# Altium project Printing.PrjPcb (part 2 of 4)

## Sheet Printing4.SchDoc
size A3
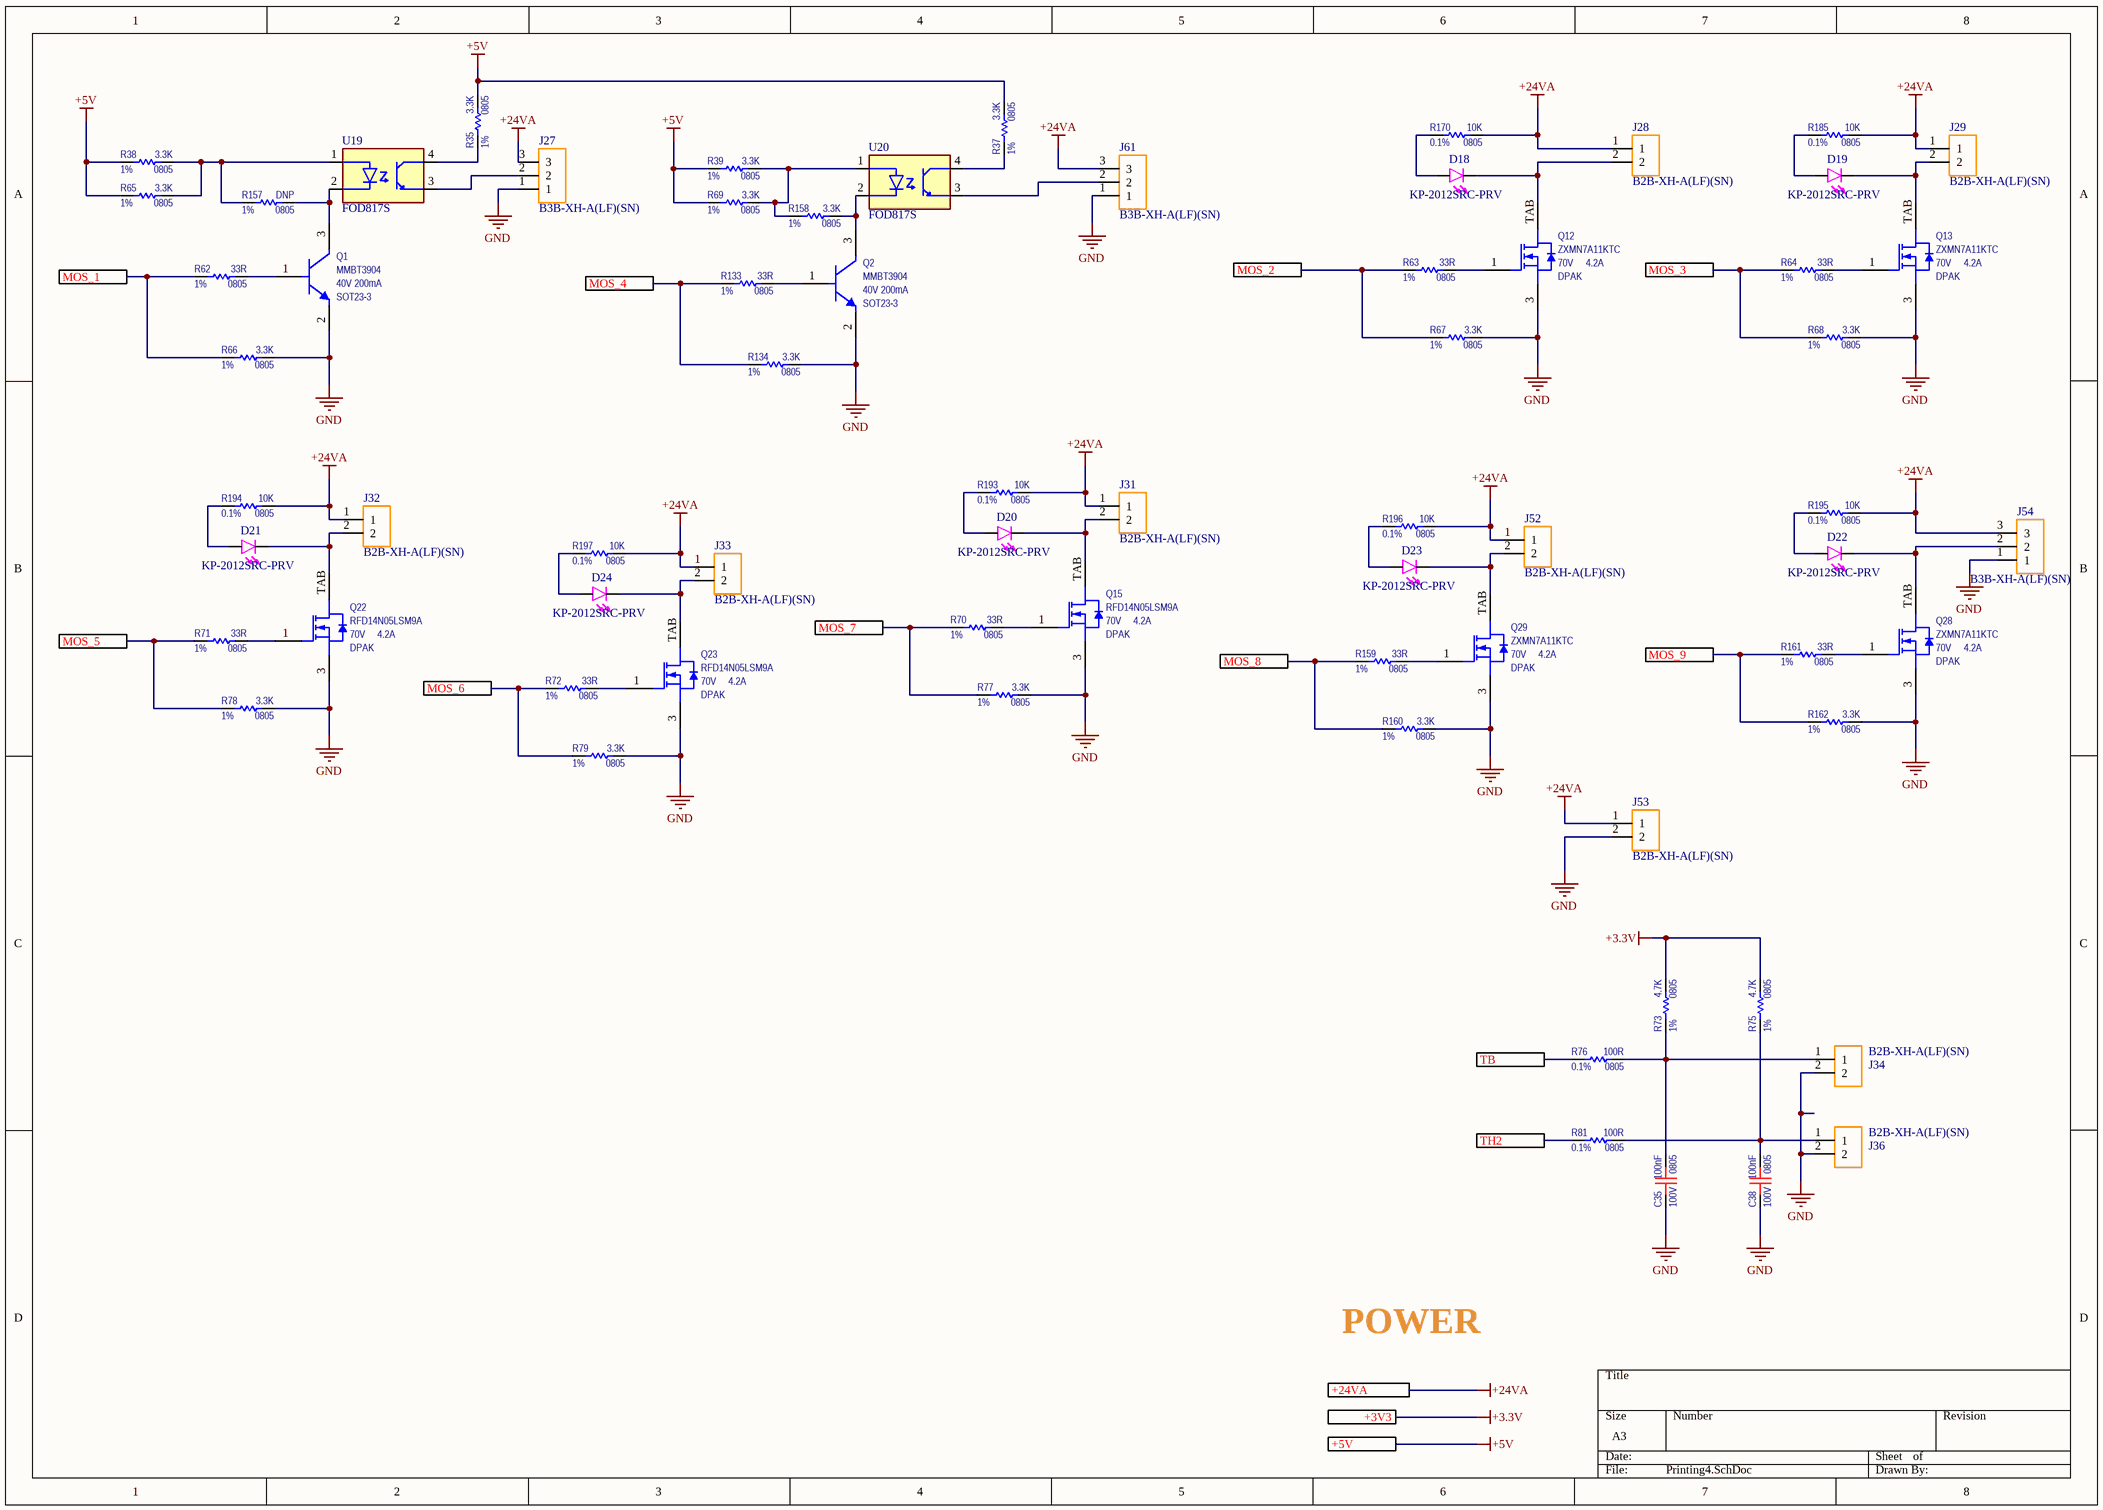
[diagram p3: Printing4.SchDoc]

### Parts
C35  value 100nF  Voltage: 100V  Package: 0805  [C_0805_GEN_1.40H]  (hidden comment: ESDSafeCapacitor)
C38  value 100nF  Voltage: 100V  Package: 0805  [C_0805_GEN_1.40H]  (hidden comment: ESDSafeCapacitor)
D18  KP-2012SRC-PRV  [0805 LED]
D19  KP-2012SRC-PRV  [0805 LED]
D20  KP-2012SRC-PRV  [0805 LED]
D21  KP-2012SRC-PRV  [0805 LED]
D22  KP-2012SRC-PRV  [0805 LED]
D23  KP-2012SRC-PRV  [0805 LED]
D24  KP-2012SRC-PRV  [0805 LED]
J27  B3B-XH-A(LF)(SN)  [JST_B3B-XH-A(LF)(SN)]
J28  B2B-XH-A(LF)(SN)  [JST_B2B-XH-A(LF)(SN)]
J29  B2B-XH-A(LF)(SN)  [JST_B2B-XH-A(LF)(SN)]
J31  B2B-XH-A(LF)(SN)  [JST_B2B-XH-A(LF)(SN)]
J32  B2B-XH-A(LF)(SN)  [JST_B2B-XH-A(LF)(SN)]
J33  B2B-XH-A(LF)(SN)  [JST_B2B-XH-A(LF)(SN)]
J34  B2B-XH-A(LF)(SN)  [JST_B2B-XH-A(LF)(SN)]
J36  B2B-XH-A(LF)(SN)  [JST_B2B-XH-A(LF)(SN)]
J52  B2B-XH-A(LF)(SN)  [JST_B2B-XH-A(LF)(SN)]
J53  B2B-XH-A(LF)(SN)  [JST_B2B-XH-A(LF)(SN)]
J54  B3B-XH-A(LF)(SN)  [JST_B3B-XH-A(LF)(SN)]
J61  B3B-XH-A(LF)(SN)  [JST_B3B-XH-A(LF)(SN)]
Q1  value MMBT3904  Current: 200mA  Voltage: 40V  Package: SOT23-3  [SOT23-3_MMBT3904,215]  (hidden comment: SingleNPN_B1E2C3)
Q2  value MMBT3904  Current: 200mA  Voltage: 40V  Package: SOT23-3  [SOT23-3_MMBT3904,215]  (hidden comment: SingleNPN_B1E2C3)
Q12  value ZXMN7A11KTC  Current: 4.2A  Voltage: 70V  Package: DPAK  [DPAK_SQD50N10-8M9L]  (hidden comment: SingleNMOS_G1S3DTAB)
Q13  value ZXMN7A11KTC  Current: 4.2A  Voltage: 70V  Package: DPAK  [DPAK_SQD50N10-8M9L]  (hidden comment: SingleNMOS_G1S3DTAB)
Q15  value RFD14N05LSM9A  Current: 4.2A  Voltage: 70V  Package: DPAK  [DPAK_SQD50N10-8M9L]  (hidden comment: SingleNMOS_G1S3DTAB)
Q22  value RFD14N05LSM9A  Current: 4.2A  Voltage: 70V  Package: DPAK  [DPAK_SQD50N10-8M9L]  (hidden comment: SingleNMOS_G1S3DTAB)
Q23  value RFD14N05LSM9A  Current: 4.2A  Voltage: 70V  Package: DPAK  [DPAK_SQD50N10-8M9L]  (hidden comment: SingleNMOS_G1S3DTAB)
Q28  value ZXMN7A11KTC  Current: 4.2A  Voltage: 70V  Package: DPAK  [DPAK_SQD50N10-8M9L]  (hidden comment: SingleNMOS_G1S3DTAB)
Q29  value ZXMN7A11KTC  Current: 4.2A  Voltage: 70V  Package: DPAK  [DPAK_SQD50N10-8M9L]  (hidden comment: SingleNMOS_G1S3DTAB)
R35  value 3.3K  Tolerance: 1%  Package: 0805  [R_0805_GEN_0.70H]  (hidden comment: StandardResistor)
R37  value 3.3K  Tolerance: 1%  Package: 0805  [R_0805_GEN_0.70H]  (hidden comment: StandardResistor)
R38  value 3.3K  Tolerance: 1%  Package: 0805  [R_0805_GEN_0.70H]  (hidden comment: StandardResistor)
R39  value 3.3K  Tolerance: 1%  Package: 0805  [R_0805_GEN_0.70H]  (hidden comment: StandardResistor)
R62  value 33R  Tolerance: 1%  Package: 0805  [R_0805_GEN_0.70H]  (hidden comment: StandardResistor)
R63  value 33R  Tolerance: 1%  Package: 0805  [R_0805_GEN_0.70H]  (hidden comment: StandardResistor)
R64  value 33R  Tolerance: 1%  Package: 0805  [R_0805_GEN_0.70H]  (hidden comment: StandardResistor)
R65  value 3.3K  Tolerance: 1%  Package: 0805  [R_0805_GEN_0.70H]  (hidden comment: StandardResistor)
R66  value 3.3K  Tolerance: 1%  Package: 0805  [R_0805_GEN_0.70H]  (hidden comment: StandardResistor)
R67  value 3.3K  Tolerance: 1%  Package: 0805  [R_0805_GEN_0.70H]  (hidden comment: StandardResistor)
R68  value 3.3K  Tolerance: 1%  Package: 0805  [R_0805_GEN_0.70H]  (hidden comment: StandardResistor)
R69  value 3.3K  Tolerance: 1%  Package: 0805  [R_0805_GEN_0.70H]  (hidden comment: StandardResistor)
R70  value 33R  Tolerance: 1%  Package: 0805  [R_0805_GEN_0.70H]  (hidden comment: StandardResistor)
R71  value 33R  Tolerance: 1%  Package: 0805  [R_0805_GEN_0.70H]  (hidden comment: StandardResistor)
R72  value 33R  Tolerance: 1%  Package: 0805  [R_0805_GEN_0.70H]  (hidden comment: StandardResistor)
R73  value 4.7K  Tolerance: 1%  Package: 0805  [R_0805_GEN_0.60H]  (hidden comment: StandardResistor)
R75  value 4.7K  Tolerance: 1%  Package: 0805  [R_0805_GEN_0.60H]  (hidden comment: StandardResistor)
R76  value 100R  Tolerance: 0.1%  Package: 0805  [R_0805_GEN_0.70H]  (hidden comment: StandardResistor)
R77  value 3.3K  Tolerance: 1%  Package: 0805  [R_0805_GEN_0.70H]  (hidden comment: StandardResistor)
R78  value 3.3K  Tolerance: 1%  Package: 0805  [R_0805_GEN_0.70H]  (hidden comment: StandardResistor)
R79  value 3.3K  Tolerance: 1%  Package: 0805  [R_0805_GEN_0.70H]  (hidden comment: StandardResistor)
R81  value 100R  Tolerance: 0.1%  Package: 0805  [R_0805_GEN_0.70H]  (hidden comment: StandardResistor)
R133  value 33R  Tolerance: 1%  Package: 0805  [R_0805_GEN_0.70H]  (hidden comment: StandardResistor)
R134  value 3.3K  Tolerance: 1%  Package: 0805  [R_0805_GEN_0.70H]  (hidden comment: StandardResistor)
R157  value DNP  Tolerance: 1%  Package: 0805  [R_0805_GEN_0.70H]  (hidden comment: StandardResistor)
R158  value 3.3K  Tolerance: 1%  Package: 0805  [R_0805_GEN_0.70H]  (hidden comment: StandardResistor)
R159  value 33R  Tolerance: 1%  Package: 0805  [R_0805_GEN_0.70H]  (hidden comment: StandardResistor)
R160  value 3.3K  Tolerance: 1%  Package: 0805  [R_0805_GEN_0.70H]  (hidden comment: StandardResistor)
R161  value 33R  Tolerance: 1%  Package: 0805  [R_0805_GEN_0.70H]  (hidden comment: StandardResistor)
R162  value 3.3K  Tolerance: 1%  Package: 0805  [R_0805_GEN_0.70H]  (hidden comment: StandardResistor)
R170  value 10K  Tolerance: 0.1%  Package: 0805  [R_0805_GEN_0.70H]  (hidden comment: StandardResistor)
R185  value 10K  Tolerance: 0.1%  Package: 0805  [R_0805_GEN_0.70H]  (hidden comment: StandardResistor)
R193  value 10K  Tolerance: 0.1%  Package: 0805  [R_0805_GEN_0.70H]  (hidden comment: StandardResistor)
R194  value 10K  Tolerance: 0.1%  Package: 0805  [R_0805_GEN_0.70H]  (hidden comment: StandardResistor)
R195  value 10K  Tolerance: 0.1%  Package: 0805  [R_0805_GEN_0.70H]  (hidden comment: StandardResistor)
R196  value 10K  Tolerance: 0.1%  Package: 0805  [R_0805_GEN_0.70H]  (hidden comment: StandardResistor)
R197  value 10K  Tolerance: 0.1%  Package: 0805  [R_0805_GEN_0.70H]  (hidden comment: StandardResistor)
U19  FOD817S  [SOIC254P1016X385-4N]
U20  FOD817S  [SOIC254P1016X385-4N]

### Ports
+3V3, +5V, +24VA, MOS_1, MOS_2, MOS_3, MOS_4, MOS_5, MOS_6, MOS_7, MOS_8, MOS_9, TB, TH2

### Nets
+3.3V: R73.2 R75.2 ; port +3V3  [project net +3V3]
+5V: R35.2 R37.2 R38.1 R39.1 R65.1 R69.1 ; port +5V
+24VA: J27.3 J28.1 J29.1 J31.1 J32.1 J33.1 J52.1 J53.1 J54.3 J61.3 R170.2 R185.2 R193.2 R194.2 R195.2 R196.2 R197.2 ; port +24VA
GND: C35.1 C38.1 J27.1 J34.2 J36.2 J53.2 J54.1 J61.1 Q1.2(EMITTER) Q2.2(EMITTER) Q12.3(SOURCE) Q13.3(SOURCE) Q15.3(SOURCE) Q22.3(SOURCE) Q23.3(SOURCE) Q28.3(SOURCE) Q29.3(SOURCE) R66.2 R67.2 R68.2 R77.2 R78.2 R79.2 R134.2 R160.2 R162.2
MOS_1: R62.1 R66.1 ; port MOS_1
MOS_2: R63.1 R67.1 ; port MOS_2
MOS_3: R64.1 R68.1 ; port MOS_3
MOS_4: R133.1 R134.1 ; port MOS_4
MOS_5: R71.1 R78.1 ; port MOS_5
MOS_6: R72.1 R79.1 ; port MOS_6
MOS_7: R70.1 R77.1 ; port MOS_7
MOS_8: R159.1 R160.1 ; port MOS_8
MOS_9: R161.1 R162.1 ; port MOS_9
TB: R76.1 ; port TB
TH2: R81.1 ; port TH2
NetC35_2: C35.2 J34.1 R73.1 R76.2
NetC38_2: C38.2 J36.1 R75.1 R81.2
NetD18_A: D18.A R170.1
NetD18_K: D18.K(C) J28.2 Q12.TAB(DRAIN)
NetD19_A: D19.A R185.1
NetD19_K: D19.K(C) J29.2 Q13.TAB(DRAIN)
NetD20_A: D20.A R193.1
NetD20_K: D20.K(C) J31.2 Q15.TAB(DRAIN)
NetD21_A: D21.A R194.1
NetD21_K: D21.K(C) J32.2 Q22.TAB(DRAIN)
NetD22_A: D22.A R195.1
NetD22_K: D22.K(C) J54.2 Q28.TAB(DRAIN)
NetD23_A: D23.A R196.1
NetD23_K: D23.K(C) J52.2 Q29.TAB(DRAIN)
NetD24_A: D24.A R197.1
NetD24_K: D24.K(C) J33.2 Q23.TAB(DRAIN)
NetJ27_2: J27.2 U19.3(EMITTER)
NetJ61_2: J61.2 U20.3(EMITTER)
NetQ1_1: Q1.1(BASE) R62.2
NetQ1_3: Q1.3(COLLECTOR) R157.2 U19.2(CATHODE)
NetQ2_1: Q2.1(BASE) R133.2
NetQ2_3: Q2.3(COLLECTOR) R158.2 U20.2(CATHODE)
NetQ12_1: Q12.1(GATE) R63.2
NetQ13_1: Q13.1(GATE) R64.2
NetQ15_1: Q15.1(GATE) R70.2
NetQ22_1: Q22.1(GATE) R71.2
NetQ23_1: Q23.1(GATE) R72.2
NetQ28_1: Q28.1(GATE) R161.2
NetQ29_1: Q29.1(GATE) R159.2
NetR35_1: R35.1 U19.4(COLLECTOR)
NetR37_1: R37.1 U20.4(COLLECTOR)
NetR38_2: R38.2 R65.2 R157.1 U19.1(ANODE)
NetR39_2: R39.2 R69.2 R158.1 U20.1(ANODE)

### Notes on the sheet
- POWER

### Library data of the parts
C35 C38 = CER_100nF_#4: CAP_CER_100nF_100V_X7R_10%_0805; Manufacturer#1: Kemet; Manufacturer#1 PN: C0805C104K1RECAUTO; Manufacturer#2 PN: ESD51C104K4T2A-24; Similar Part: C0805C104J1RECAUTO7210; C0805X104J1RECAUTO; Added by: İlhanT; FireANTs Code: C00062; Grade Level: Automotive; Lead Status: Pb-Free; Location: 3B16; Max Reflow Duration: 30; Max Reflow Temp: 260; Placement Area: 10.45; Power Rating: X; Temp# Operating: -55°C/+125°C; Tolerance: 10%; Identifier: CER_100nF_#4; Checked by: İlkerU; ComponentLink1Description: Resource Folder; ComponentLink1URL: C:\FireANTs_Repo\HW_Lib\trunk\ComponentLibrary\Resources\Capacitors\C00062; Cost: 0.27; Current: N/A; Failure in Time: N/A; Features: AEC-Q200; ESD withstanding; Height: 1.40; Manufacturer#2: AVX; MSL: 1; Mounting Type: SMD; Part Status: Active; Temp# Storage: N/A; Weight: 19mg
D18-D24 = KP-2012SRC-PRV: KP-2012SRC-PRV Red LED, 640 nm 2012 (0805), Rectangle Lens SMD package; Manufacturer: Kingbright; Lens Color: Clear; Viewing Angle: 120°; Lens Style: Rectangular,Diffused,Colorless; Number of LEDs: 1; Wavelength: 640nm; Luminous Intensity: 100mcd; Forward Voltage: 1.85V; Forward Current: 20mA; Supplier 1: Farnell; Manufacturer Part Number: KP-2012SRC-PRV; RoHS: Yes; Category: LEDs; Pricing 1: 5=0,12900, 50=0,10200, 100=0,09830, 500=0,08370, 1000=0,07290 (EUR); Mount: Surface Mount; Case/Package: 2012; Number of Pins: 2; Color: Red; Min Operating Temperature: -40°C; Max Operating Temperature: 85°C; Packaging: Cut Tape; Dominant Wavelength: 640nm; Radiation Hardening: No; Reach SVHC Compliant: Yes; RoHS Compliant: Yes; ComponentLink1URL: https://datasheet.ciiva.com/14176/kp2012src-prv-eng-tds-14176962.pdf?src-supplier=Distrelec; ComponentLink1Description: https://datasheet.ciiva.com/14176/kp2012src-prv-eng-tds-14176962.pdf?src-supplier=Distrelec; ComponentLink2URL: https://datasheet.ciiva.com/11773/0900766b8032fa8d-11773524.pdf?src-supplier=RSComponents; ComponentLink2Description: https://datasheet.ciiva.com/11773/0900766b8032fa8d-11773524.pdf?src-supplier=RSComponents; ComponentLink3URL: https://datasheet.ciiva.com/14634/0900766b8032fa8d-14634746.pdf?src-supplier=Allied+Electronics; ComponentLink3Description: https://datasheet.ciiva.com/14634/0900766b8032fa8d-14634746.pdf?src-supplier=Allied+Electronics; ComponentLink4URL: https://datasheet.ciiva.com/29281/180105-da-01-en-led-0805-typ-kp-2012src-prv-29281248.pdf?src-supplier=Conrad; ComponentLink4Description: https://datasheet.ciiva.com/29281/180105-da-01-en-led-0805-typ-kp-2012src-prv-29281248.pdf?src-supplier=Conrad; Supplier Part Number 1: 1318244
J28 J29 J31-J34 J36 J52 J53 = B2B-XH-A(LF)(SN): Connector Header Through Hole 2 position 0.098 (2.50mm); MF: JST Sales; MP: B2B-XH-A(LF)(SN); Package: None; SnapEDA_Link: https://www.snapeda.com/parts/B2B-XH-A(LF)(SN)/JST+Sales+America+Inc./view-part/?ref=snap; Purchase-URL: https://pricing.snapeda.com/search/part/B2B-XH-A(LF)(SN)/?ref=eda; Check_prices: https://www.snapeda.com/parts/B2B-XH-A(LF)(SN)/JST+Sales+America+Inc./view-part/?ref=eda; Availability: In Stock; Value: *; Price: None
Q1 Q2 = NPN_40V-200mA_#1: TRA_NPN_SING_40V_200mA_VSAT300mV_SOT23-3; Manufacturer#1: Nexperia; Manufacturer#1 PN: MMBT3904,215; Manufacturer#2 PN: MMBT3904-7-F; Similar Part: SST3904HZGT116; PMBT3904,235; Added by: HasanA; FireANTs Code: Q00012; Failure in Time: 0.44@[60%CL; 55°C; 0.7eV]; Grade Level: Industrial; Lead Status: Pb-Free; Location: 4D3; Max Reflow Duration: 30; Max Reflow Temp: 260; Placement Area: 14.00; Power Rating: X; Temp# Operating: -65°C/+150°C; Identifier: NPN_40V-200mA_#1; Checked by: EserC; ComponentLink1Description: Resource Folder; ComponentLink1URL: C:\BNA_Repo\HW_Lib\trunk\ComponentLibrary\Resources\Transistors\Q00012; Cost: 0.10; Features: Single NPN signal BJT; Height: 1.10; Manufacturer#2: Diodes; MSL: 1; Mounting Type: SMD; Part Status: Active; Temp# Storage: -65°C/+150°C; Tolerance: X; Weight: 7.48mg
Q12 Q13 Q15 Q22 Q23 Q28 Q29 = NMOS_100V-50A_#1: TRA_NMOS_SING_100V_50A_TH2V_DPAK; Manufacturer#1: Vishay; Manufacturer#1 PN: SQD50N10-8M9L; Similar Part: SQM70060EL_GE3; SQM100N10-10_GE3; Added by: İlhanT; FireANTs Code: Q00028; Failure in Time: 1.84@[60%CL; 55°C; 0.7eV]; Grade Level: Automotive; Lead Status: Pb-Free; Location: 4D7; Max Reflow Duration: 10; Max Reflow Temp: 260; Placement Area: 97.50; Power Rating: X; Temp# Operating: -55°C/+175°C; Identifier: NMOS_100V-50A_#1; Checked by: YasinY; ComponentLink1Description: Resource Folder; ComponentLink1URL: C:\BNA_Repo\HW_Lib\trunk\ComponentLibrary\Resources\Transistors\Q00028; Cost: 1.54; Features: AEC-Q101;  Single nMOS; Rdson=11.2mR@Vgs=4.5V@25°C; Qgate(tot)=70nC; Vgsmax=±20V; Height: 2.38; Manufacturer#2: N/A; Manufacturer#2 PN: N/A; MSL: 1; Mounting Type: SMD; Part Status: Active; Temp# Storage: -55°C/+175°C; Tolerance: X; Weight: 370mg
R35 R37-R39 R65-R69 R77-R79 R134 R157 R158 R160 R162 = STD_3.3K_#3: RES_STD_3.3K_0.125W_1%_100ppm_0805; Manufacturer#1: Yageo; Manufacturer#1 PN: AC0805FR-073K3L; Manufacturer#2 PN: ERJ-6ENF3301V; Added by: HasanA; FireANTs Code: R00131; Current: X; Grade Level: Automotive; Lead Status: Pb-Free; Location: 2G8; Max Reflow Duration: 10; Max Reflow Temp: 260; Placement Area: 10.45; Power Rating: 125mW; Temp# Operating: -55°C/+155°C; Voltage: 150V; Identifier: STD_3.3K_#3; Checked by: YasinY; ComponentLink1Description: Resource Folder; ComponentLink1URL: C:\FireANTs_Repo\HW_Lib\trunk\ComponentLibrary\Resources\Resistors\R00131; Cost: 0.10; Failure in Time: N/A; Features: AEC-Q200; Height: 0.70; Manufacturer#2: Panasonic; MSL: 1; Mounting Type: SMD; Part Status: Active; Similar Part: N/A; Temp# Storage: N/A; Weight: 5.5mg
R62-R64 R70-R72 R133 R159 R161 = STD_33R_#3: RES_STD_33R_0.125W_1%_100ppm_0805; Manufacturer#1: Yageo; Manufacturer#1 PN: AC0805FR-0733RL; Manufacturer#2 PN: ERJ-6ENF33R0V; Added by: HasanA; FireANTs Code: R00051; Current: X; Grade Level: Automotive; Lead Status: Pb-Free; Location: 2C13; Max Reflow Duration: 10; Max Reflow Temp: 260; Placement Area: 10.45; Power Rating: 125mW; Temp# Operating: -55°C/+155°C; Voltage: 150V; Identifier: STD_33R_#3; Checked by: YasinY; ComponentLink1Description: Resource Folder; ComponentLink1URL: C:\FireANTs_Repo\HW_Lib\trunk\ComponentLibrary\Resources\Resistors\R00051; Cost: 0.10; Failure in Time: N/A; Features: AEC-Q200; Height: 0.70; Manufacturer#2: Panasonic; MSL: 1; Mounting Type: SMD; Part Status: Active; Similar Part: N/A; Temp# Storage: N/A; Weight: 5.5mg
R73 R75 = STD_4.7K_#3: RES_STD_4.7K_0.125W_1%_100ppm_0805; Manufacturer#1: Yageo; Manufacturer#1 PN: AC0805FR-074K7L; Manufacturer#2 PN: ERJ-6ENF4701V; Added by: SonerI; FireANTs Code: R00230; Current: X; Grade Level: Automotive; Lead Status: Pb-Free; Location: TBD; Max Reflow Duration: 10; Max Reflow Temp: 260; Placement Area: 10.45; Power Rating: 125mW; Temp# Operating: -55°C/+155°C; Voltage: 150V; Identifier: STD_4.7K_#3; Checked by: YasinY; ComponentLink1Description: Resource Folder; ComponentLink1URL: C:\FireANTs_Repo\HW_Lib\trunk\ComponentLibrary\Resources\Resistors\R00230; Cost: 0.10; Failure in Time: N/A; Features: AEC-Q200; Height: 0.60; Manufacturer#2: Panasonic; MSL: 1; Mounting Type: SMD; Part Status: Active; Similar Part: N/A; Temp# Storage: N/A; Weight: 5.5mg
R76 R81 = STD_100R_#5: RES_STD_100R_0.125W_0.1%_10ppm_0805; Manufacturer#1: Yageo; Manufacturer#1 PN: RT0805BRB07100RL; Manufacturer#2 PN: RQ73C2A100RBTD; Similar Part: RNCF0805TKY100R; RG2012N-101-W-T1; Added by: HasanA; FireANTs Code: R00072; Current: X; Grade Level: Industrial; Lead Status: Pb-Free; Location: 2D18; Max Reflow Duration: 10; Max Reflow Temp: 260; Placement Area: 10.45; Power Rating: 125mW; Temp# Operating: -55°C/+155°C; Voltage: 150V; Identifier: STD_100R_#5; Checked by: YasinY; ComponentLink1Description: Resource Folder; ComponentLink1URL: C:\FireANTs_Repo\HW_Lib\trunk\ComponentLibrary\Resources\Resistors\R00072; Cost: 0.73; Failure in Time: N/A; Features: N/A; Height: 0.70; Manufacturer#2: TE Connectivity; MSL: 1; Mounting Type: SMD; Part Status: Active; Temp# Storage: N/A; Weight: 5.5mg
R170 R185 R193-R197 = STD_2K_#7: RES_STD_2K_0.125W_0.1%_25ppm_0805; Manufacturer#1: Panasonic; Manufacturer#1 PN: ERA-6AEB202V; Manufacturer#2 PN: RG2012P-202-B-T5; Similar Part: ERA-6ARB202V; Added by: İlhanT; FireANTs Code: R00087; Current: X; Grade Level: Automotive; Lead Status: Pb-Free; Location: 2C22; Max Reflow Duration: 10; Max Reflow Temp: 260; Placement Area: 10.45; Power Rating: 125mW; Temp# Operating: -55°C/+155°C; Voltage: 100V; Identifier: STD_2K_#7; Checked by: YasinY; ComponentLink1Description: Resource Folder; ComponentLink1URL: C:\FireANTs_Repo\HW_Lib\trunk\ComponentLibrary\Resources\Resistors\R00087; Cost: 0.31; Failure in Time: N/A; Features: AEC-Q200; Height: 0.70; Manufacturer#2: Susumu; MSL: 1; Mounting Type: SMD; Part Status: Active; Temp# Storage: N/A; Weight: 5.5mg
U19 U20 = FOD817S: Optoisolator Transistor Output 5000Vrms 1 Channel 4-SMD; MF: ON Semiconductor; Price: None; Availability: Unavailable; Package: SMD-4 ON Semiconductor; SnapEDA_Link: https://www.snapeda.com/parts/FOD817S/ON%20Semiconductor/view-part/2890432/?ref=snap; MP: FOD817S; Value: *
J27 J54 J61 = B3B-XH-A(LF)(SN): Value: *; MP: B3B-XH-A(LF)(SN); Availability: Unavailable; Package: None; Price: None

## Sheet Printing6.SchDoc
size A3
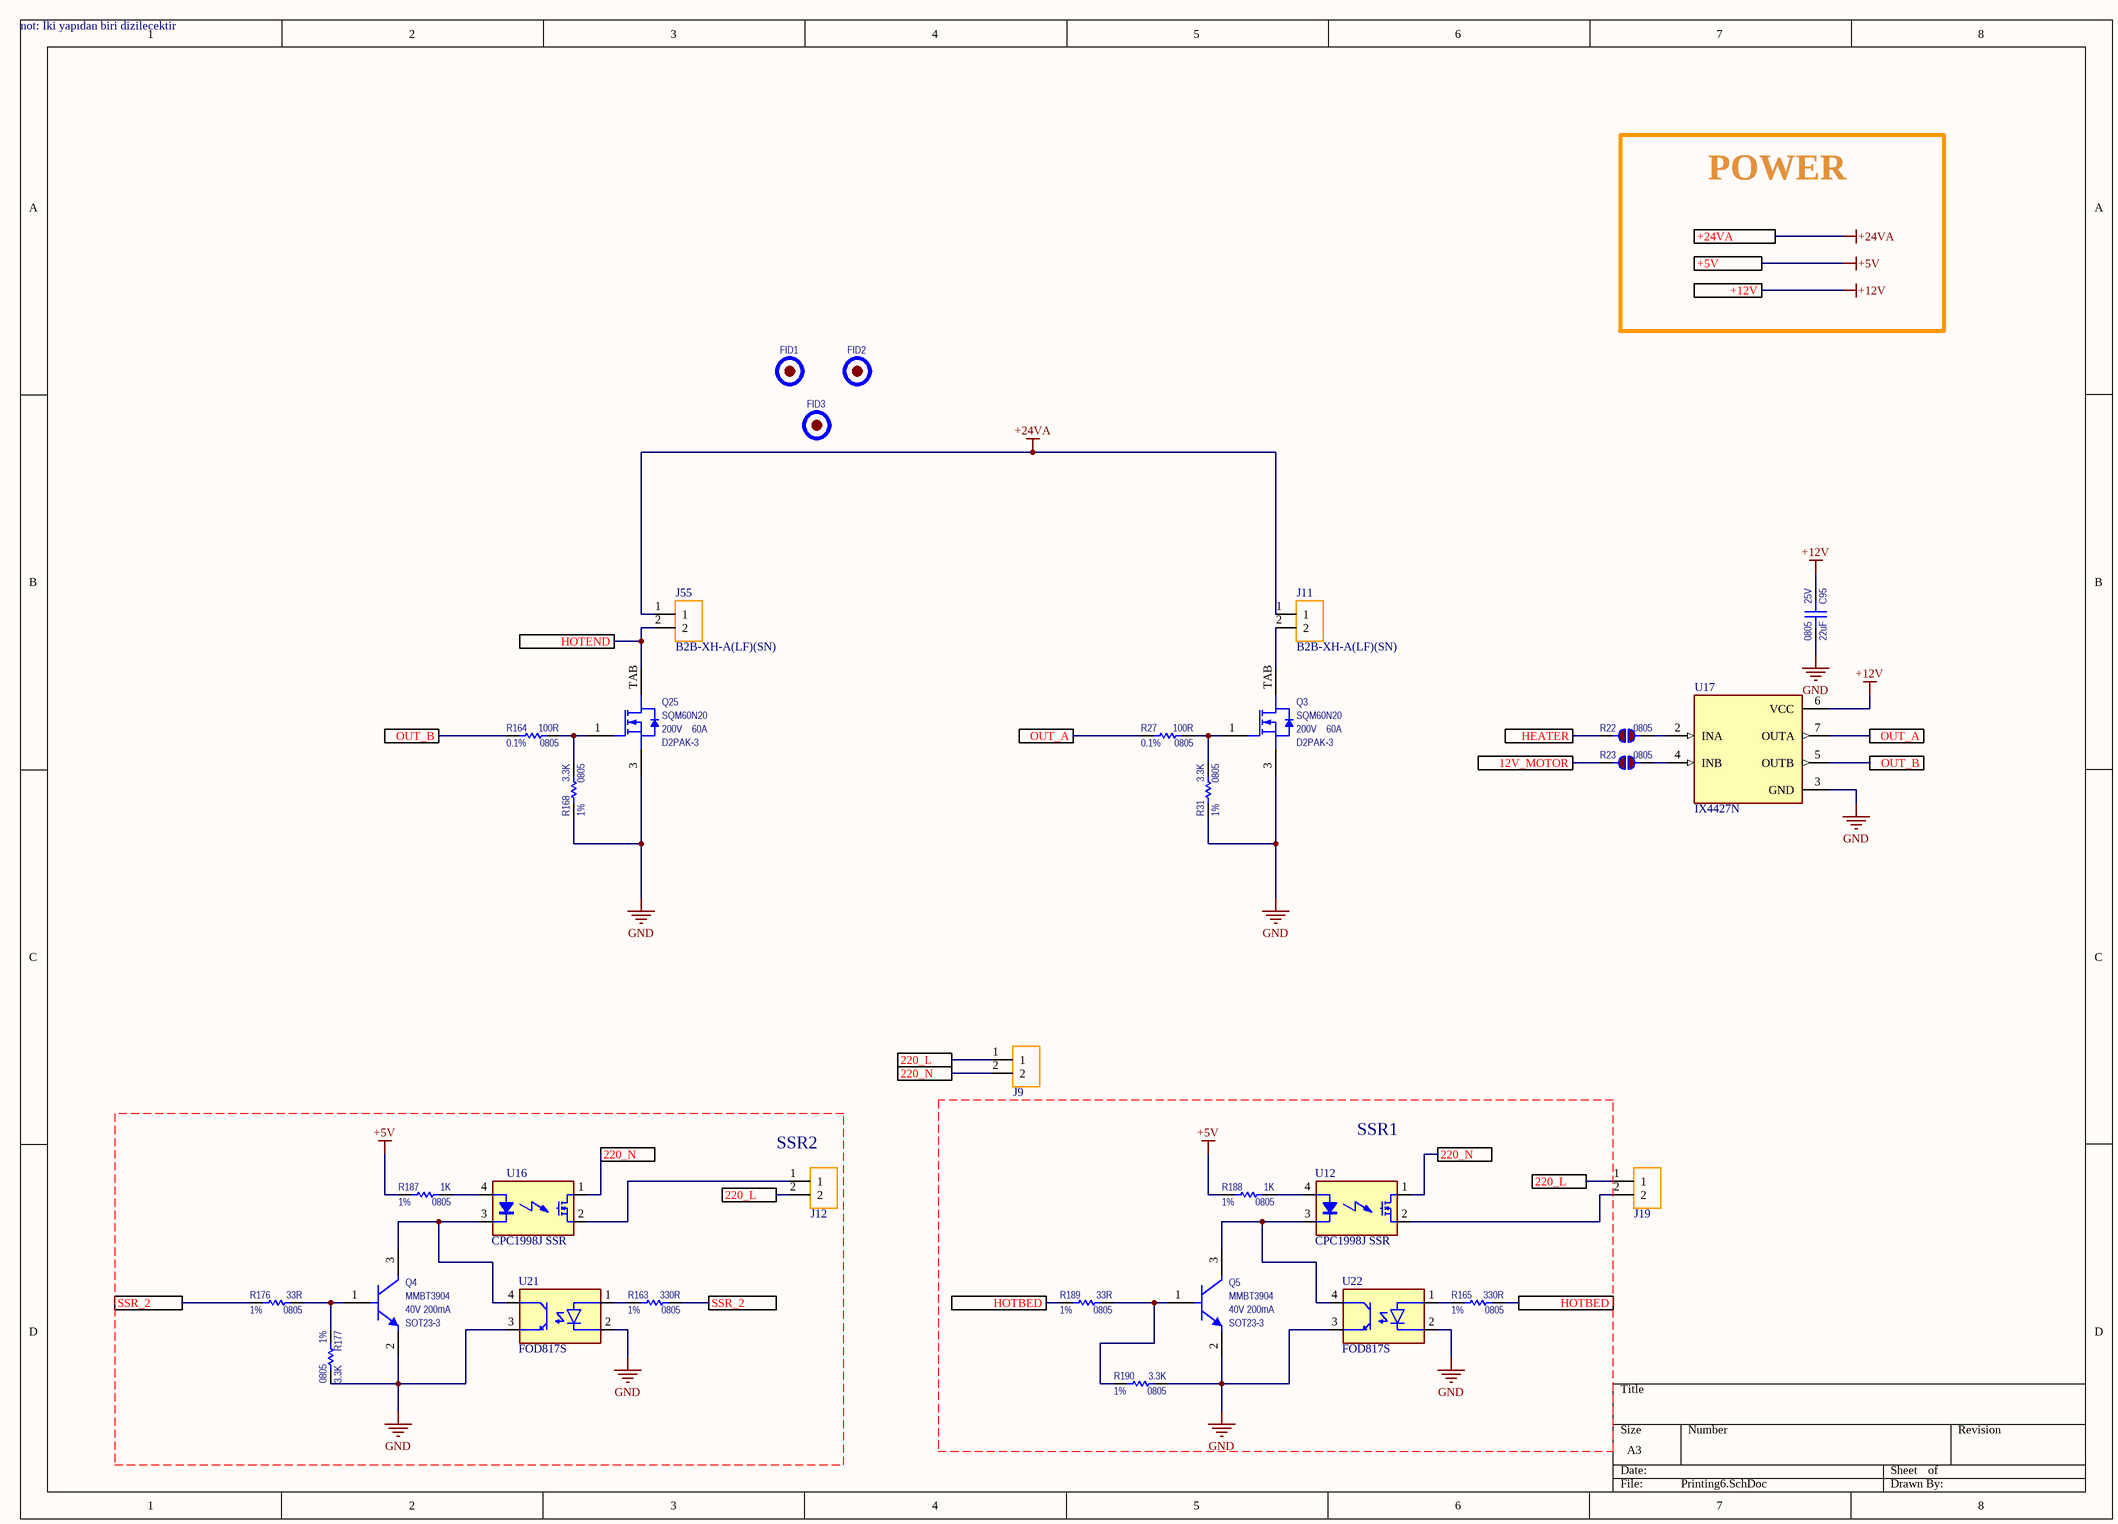
[diagram p4: Printing6.SchDoc]

### Parts
C95  value 22uF  Voltage: 25V  Package: 0805  [C_0805_GEN_1.40H]  (hidden comment: Capacitor)
FID1  Fiducial_1.00x3.00  [SMD_1.00x3.00_FID]  (value not drawn)
FID2  Fiducial_1.00x3.00  [SMD_1.00x3.00_FID]  (value not drawn)
FID3  Fiducial_1.00x3.00  [SMD_1.00x3.00_FID]  (value not drawn)
J9  5.08 Klemens  [5.08 Klemens]  (value not drawn)
J11  B2B-XH-A(LF)(SN)  [JST_B2B-XH-A(LF)(SN)]
J12  5.08 Klemens  [5.08 Klemens]  (value not drawn)
J19  5.08 Klemens  [5.08 Klemens]  (value not drawn)
J55  B2B-XH-A(LF)(SN)  [JST_B2B-XH-A(LF)(SN)]
Q3  value SQM60N20  Current: 60A  Voltage: 200V  Package: D2PAK-3  [D2PAK-3_SQM60N20-35]  (hidden comment: SingleNMOS_G1S3DTAB)
Q4  value MMBT3904  Current: 200mA  Voltage: 40V  Package: SOT23-3  [SOT23-3_MMBT3904,215]  (hidden comment: SingleNPN_B1E2C3)
Q5  value MMBT3904  Current: 200mA  Voltage: 40V  Package: SOT23-3  [SOT23-3_MMBT3904,215]  (hidden comment: SingleNPN_B1E2C3)
Q25  value SQM60N20  Current: 60A  Voltage: 200V  Package: D2PAK-3  [D2PAK-3_SQM60N20-35]  (hidden comment: SingleNMOS_G1S3DTAB)
R22  Package: 0805  [R_0805_GEN_0.70H]  (hidden comment: StandardJumper)
R23  Package: 0805  [R_0805_GEN_0.70H]  (hidden comment: StandardJumper)
R27  value 100R  Tolerance: 0.1%  Package: 0805  [R_0805_GEN_0.70H]  (hidden comment: StandardResistor)
R31  value 3.3K  Tolerance: 1%  Package: 0805  [R_0805_GEN_0.70H]  (hidden comment: StandardResistor)
R163  value 330R  Tolerance: 1%  Package: 0805  [R_0805_GEN_0.70H]  (hidden comment: StandardResistor)
R164  value 100R  Tolerance: 0.1%  Package: 0805  [R_0805_GEN_0.70H]  (hidden comment: StandardResistor)
R165  value 330R  Tolerance: 1%  Package: 0805  [R_0805_GEN_0.70H]  (hidden comment: StandardResistor)
R168  value 3.3K  Tolerance: 1%  Package: 0805  [R_0805_GEN_0.70H]  (hidden comment: StandardResistor)
R176  value 33R  Tolerance: 1%  Package: 0805  [R_0805_GEN_0.70H]  (hidden comment: StandardResistor)
R177  value 3.3K  Tolerance: 1%  Package: 0805  [R_0805_GEN_0.70H]  (hidden comment: StandardResistor)
R187  value 1K  Tolerance: 1%  Package: 0805  [R_0805_GEN_0.70H]  (hidden comment: StandardResistor)
R188  value 1K  Tolerance: 1%  Package: 0805  [R_0805_GEN_0.70H]  (hidden comment: StandardResistor)
R189  value 33R  Tolerance: 1%  Package: 0805  [R_0805_GEN_0.70H]  (hidden comment: StandardResistor)
R190  value 3.3K  Tolerance: 1%  Package: 0805  [R_0805_GEN_0.70H]  (hidden comment: StandardResistor)
U12  CPC1998J SSR  [I4-PAC]
U16  CPC1998J SSR  [I4-PAC]
U17  IX4427N  [SOIC127P600X175-8N]
U21  FOD817S  [SOIC254P1016X385-4N]
U22  FOD817S  [SOIC254P1016X385-4N]

### Ports
12V_MOTOR, 220_L, 220_N, +5V, +12V, +24VA, HEATER, HOTBED, HOTEND, OUT_A, OUT_B, SSR_2

### Nets
+5V: R187.1 R188.1 ; port +5V
+12V: C95.1 U17.6(VCC) ; port +12V
+24VA: J11.1 J55.1 ; port +24VA
GND: C95.2 Q3.3(SOURCE) Q4.2(EMITTER) Q5.2(EMITTER) Q25.3(SOURCE) R31.1 R168.1 R177.2 R190.2 U17.3(GND) U21.2(CATHODE) U21.3(EMITTER) U22.2(CATHODE) U22.3(EMITTER)
12V_MOTOR: R23.1 ; port 12V_MOTOR
220_L: J9.1 J12.2 J19.1 ; port 220_L
220_N: J9.2 U12.1(DS1) U16.1(DS1) ; port 220_N
HEATER: R22.1 ; port HEATER
HOTBED: R165.2 R189.1 ; port HOTBED
HOTEND: J55.2 Q25.TAB(DRAIN) ; port HOTEND
OUT_A: R27.1 U17.7(OUTA) ; port OUT_A
OUT_B: R164.1 U17.5(OUTB) ; port OUT_B
SSR_2: R163.2 R176.1 ; port SSR_2
NetJ11_2: J11.2 Q3.TAB(DRAIN)
NetJ12_1: J12.1 U16.2(DS2)
NetJ19_2: J19.2 U12.2(DS2)
NetQ3_1: Q3.1(GATE) R27.2 R31.2
NetQ4_1: Q4.1(BASE) R176.2 R177.1
NetQ4_3: Q4.3(COLLECTOR) U16.3(K) U21.4(COLLECTOR)
NetQ5_1: Q5.1(BASE) R189.2 R190.1
NetQ5_3: Q5.3(COLLECTOR) U12.3(K) U22.4(COLLECTOR)
NetQ25_1: Q25.1(GATE) R164.2 R168.2
NetR22_2: R22.2 U17.2(INA)
NetR23_2: R23.2 U17.4(INB)
NetR163_1: R163.1 U21.1(ANODE)
NetR165_1: R165.1 U22.1(ANODE)
NetR187_2: R187.2 U16.4(A)
NetR188_2: R188.2 U12.4(A)

### Notes on the sheet
- not: İki yapıdan biri dizilecektir
- POWER
- SSR1
- (near J12) SSR2

### Library data of the parts
C95 = CER_22uF_#6: CAP_CER_22uF_25V_X5R_20%_0805; Manufacturer#1: Murata; Manufacturer#1 PN: GRM21BR61E226ME44L; Manufacturer#2 PN: CC0805MKX5R8BB226; Similar Part: GRT21BR61E226ME13L; C2012X5R1V226M125AC; Added by: HasanA; FireANTs Code: C00159; Grade Level: Industrial; Lead Status: Pb-Free; Location: 3G15; Max Reflow Duration: 30; Max Reflow Temp: 260; Placement Area: 10.45; Power Rating: X; Temp# Operating: -55°C/+85°C; Tolerance: 20%; Identifier: CER_22uF_#6; Checked by: İlkerU; ComponentLink1Description: Resource Folder; ComponentLink1URL: C:\FireANTs_Repo\HW_Lib\trunk\ComponentLibrary\Resources\Capacitors\C00159; Cost: 0.54; Current: N/A; Failure in Time: N/A; Features: N/A; Height: 1.40; Manufacturer#2: Yageo; MSL: 1; Mounting Type: SMD; Part Status: Active; Temp# Storage: N/A; Weight: 19mg
FID1-FID3 = FID_1.00X3.00: SUP_FID_1.00x3.00_SMD; Value: X; Added by: İlhanT; Placement Area: 12.56; Package: X; Identifier: FID_1.00X3.00; FireANTs Code: X; Checked by: HasanA; ComponentLink1Description: X; ComponentLink1URL: X; Cost: X; Current: X; Failure in Time: X; Features: X; Grade Level: X; Height: 0; Lead Status: X; Location: X; Manufacturer#1: X; Manufacturer#1 PN: X; Manufacturer#2: X; Manufacturer#2 PN: X; Max Reflow Duration: X; Max Reflow Temp: X; MSL: X; Mounting Type: X; Part Status: X; Power Rating: X; Similar Part: X; Temp# Operating: X; Temp# Storage: X; Tolerance: X; Voltage: X; Weight: X
J11 J55 = B2B-XH-A(LF)(SN): as J28 on sheet Printing4; MP: B2B-XH-A(LF)(SN); Package: None; SnapEDA_Link: https://www.snapeda.com/parts/B2B-XH-A(LF)(SN)/JST+Sales+America+Inc./view-part/?ref=snap; Purchase-URL: https://pricing.snapeda.com/search/part/B2B-XH-A(LF)(SN)/?ref=eda; Check_prices: https://www.snapeda.com/parts/B2B-XH-A(LF)(SN)/JST+Sales+America+Inc./view-part/?ref=eda; Availability: In Stock; Value: *; Price: None
Q3 Q25 = NMOS_200V-60A_#1: TRA_NMOS_SING_200V_60A_TH3V_DPAK; Manufacturer#1: Vishay; Manufacturer#1 PN: SQM60N20-35_GE3; Similar Part: SQM10250E_GE3; Added by: İlhanT; FireANTs Code: Q00029; Failure in Time: 0.57@[60%CL; 55°C; 0.7eV]; Grade Level: Automotive; Lead Status: Pb-Free; Location: 4A8; Max Reflow Duration: 10; Max Reflow Temp: 260; Placement Area: 210.00; Power Rating: X; Temp# Operating: -55°C/+175°C; Identifier: NMOS_200V-60A_#1; Checked by: EserC; ComponentLink1Description: Resource Folder; ComponentLink1URL: C:\BNA_Repo\HW_Lib\trunk\ComponentLibrary\Resources\Transistors\Q00029; Cost: 2.86; Features: AEC-Q101;  Single nMOS; Rdson=35mR@Vgs=10V@25°C; Qgate(tot)=135nC; Vgsmax=±20V; Height: 4.83; Manufacturer#2: N/A; Manufacturer#2 PN: N/A; MSL: 1; Mounting Type: SMD; Part Status: Active; Temp# Storage: -55°C/+175°C; Tolerance: X; Weight: 1565mg
Q4 Q5 = NPN_40V-200mA_#1: as Q1 on sheet Printing4; Identifier: NPN_40V-200mA_#1; Checked by: EserC; ComponentLink1Description: Resource Folder; ComponentLink1URL: C:\BNA_Repo\HW_Lib\trunk\ComponentLibrary\Resources\Transistors\Q00012; Cost: 0.10; Features: Single NPN signal BJT; Height: 1.10; Manufacturer#2: Diodes; MSL: 1; Mounting Type: SMD; Part Status: Active; Temp# Storage: -65°C/+150°C; Tolerance: X; Weight: 7.48mg
R22 R23 = STD_JUMPER_#3: RES_STD_0R_0.125W_0805; Manufacturer#1: Yageo; Manufacturer#1 PN: AC0805JR-070RL; Manufacturer#2 PN: ERJ-6GEY0R00V; Value: 0R; Added by: İlhanT; FireANTs Code: R00008; Current: X; Grade Level: Automotive; Lead Status: Pb-Free; Location: 2D2; Max Reflow Duration: 10; Max Reflow Temp: 260; Placement Area: 10.45; Power Rating: 125mW; Temp# Operating: -55°C/+155°C; Tolerance: 5%; Voltage: 150V; Identifier: STD_JUMPER_#3; Checked by: YasinY; ComponentLink1Description: Resource Folder; ComponentLink1URL: C:\FireANTs_Repo\HW_Lib\trunk\ComponentLibrary\Resources\Resistors\R00008; Cost: 0.10; Failure in Time: N/A; Features: AEC-Q200; Height: 0.70; Manufacturer#2: Panasonic; MSL: 1; Mounting Type: SMD; Part Status: Active; Similar Part: N/A; Temp# Storage: N/A; Weight: 5.5mg
R27 R164 = STD_100R_#5: as R76 on sheet Printing4; Identifier: STD_100R_#5; Checked by: YasinY; ComponentLink1Description: Resource Folder; ComponentLink1URL: C:\FireANTs_Repo\HW_Lib\trunk\ComponentLibrary\Resources\Resistors\R00072; Cost: 0.73; Failure in Time: N/A; Features: N/A; Height: 0.70; Manufacturer#2: TE Connectivity; MSL: 1; Mounting Type: SMD; Part Status: Active; Temp# Storage: N/A; Weight: 5.5mg
R31 R168 R177 R187 R188 R190 = STD_3.3K_#3: as R35 on sheet Printing4; Identifier: STD_3.3K_#3; Checked by: YasinY; ComponentLink1Description: Resource Folder; ComponentLink1URL: C:\FireANTs_Repo\HW_Lib\trunk\ComponentLibrary\Resources\Resistors\R00131; Cost: 0.10; Failure in Time: N/A; Features: AEC-Q200; Height: 0.70; Manufacturer#2: Panasonic; MSL: 1; Mounting Type: SMD; Part Status: Active; Similar Part: N/A; Temp# Storage: N/A; Weight: 5.5mg
R163 R165 R176 R189 = STD_33R_#3: as R62 on sheet Printing4; Identifier: STD_33R_#3; Checked by: YasinY; ComponentLink1Description: Resource Folder; ComponentLink1URL: C:\FireANTs_Repo\HW_Lib\trunk\ComponentLibrary\Resources\Resistors\R00051; Cost: 0.10; Failure in Time: N/A; Features: AEC-Q200; Height: 0.70; Manufacturer#2: Panasonic; MSL: 1; Mounting Type: SMD; Part Status: Active; Similar Part: N/A; Temp# Storage: N/A; Weight: 5.5mg
U12 U16 = CPC1998J
U17 = IX4427N: Low-Side Gate Driver IC Non-Inverting 8-SOIC; MF: IXYS Integrated; Value: *; MP: IX4427N; Package: SOIC-8 IXYS; Availability: Good; DigiKey-Purchase-URL: https://snapeda.com/shop?store=DigiKey&id=610744; Price: None; SnapEDA_Link: https://www.snapeda.com/parts/IX4427N/IXYS%20Integrated%20Circuits%20Division/view-part/610744/?ref=snap; Mouser-Purchase-URL: https://snapeda.com/shop?store=Mouser&id=610744; Arrow_Electronics-Purchase-URL: https://snapeda.com/shop?store=Arrow+Electronics&id=610744
U21 U22 = FOD817S: as U19 on sheet Printing4; Price: None; Availability: Unavailable; Package: SMD-4 ON Semiconductor; SnapEDA_Link: https://www.snapeda.com/parts/FOD817S/ON%20Semiconductor/view-part/2890432/?ref=snap; MP: FOD817S; Value: *

## Sheet Printing.SchDoc
size A2; Organization: Altium Limited; Address1: L3, 12a Rodborough Rd; Address2: Frenchs Forest; Address3: NSW; Address4: Australia 2086
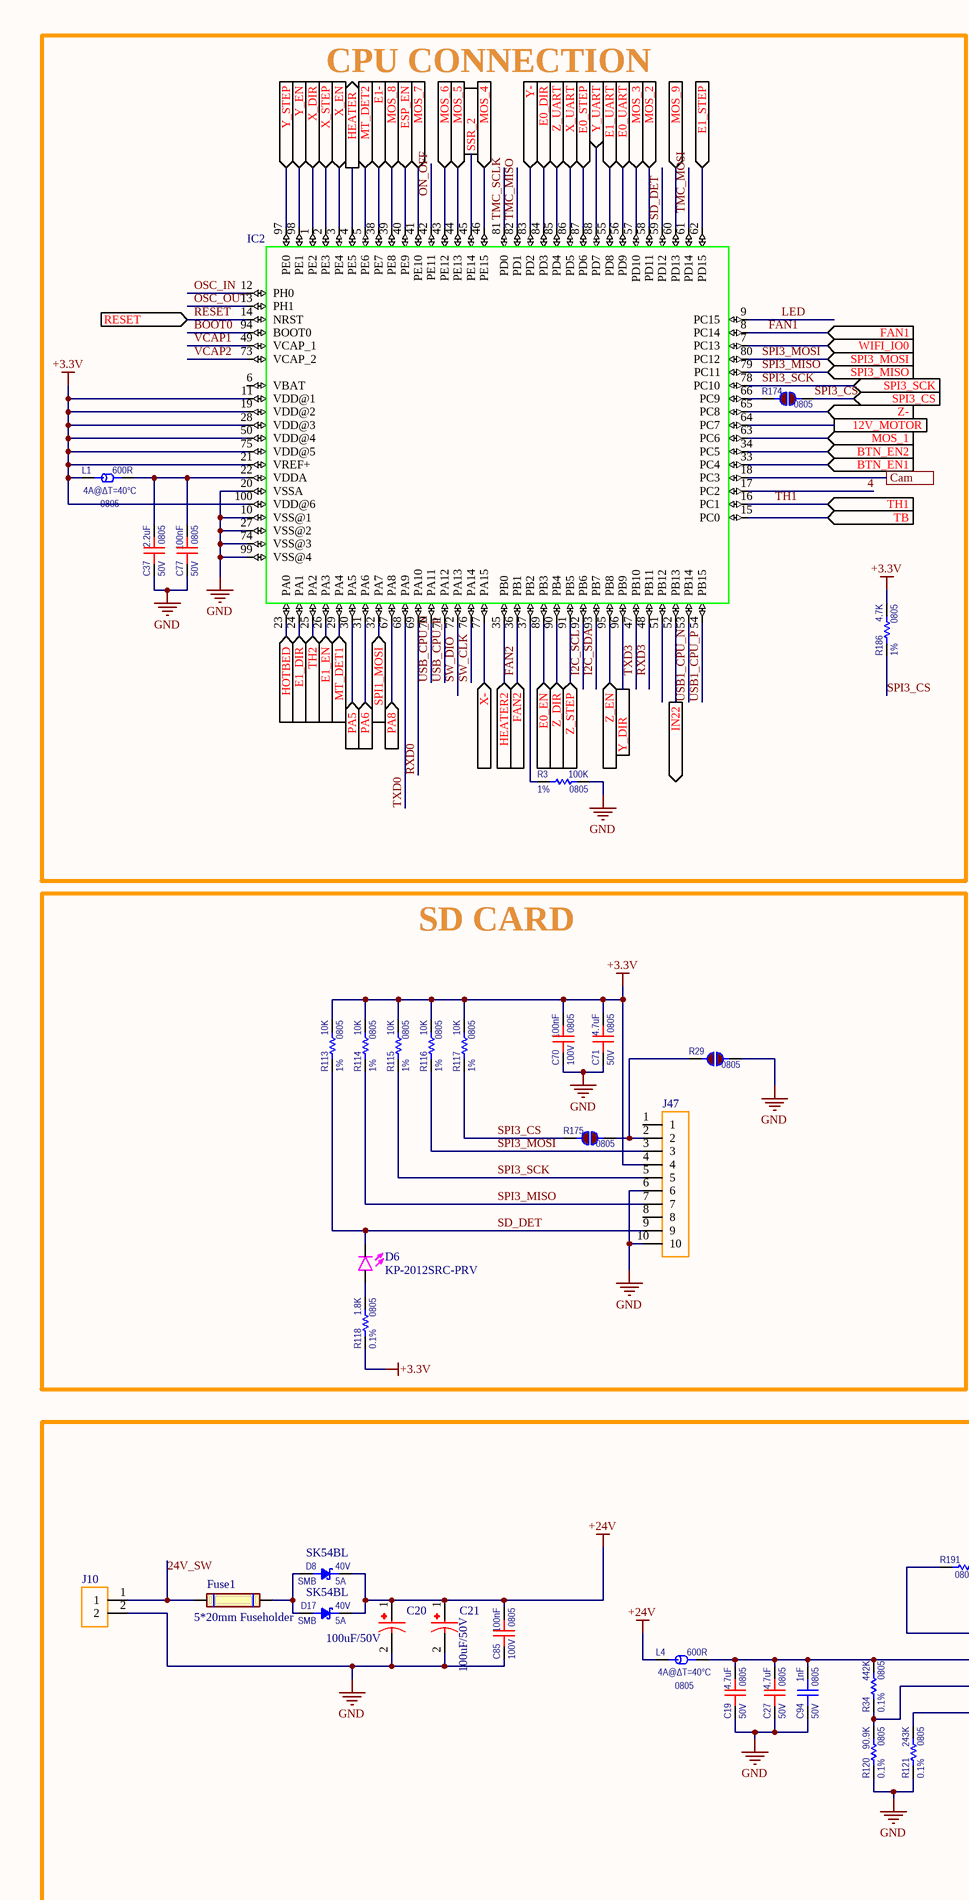
[diagram p5: Printing.SchDoc, left]
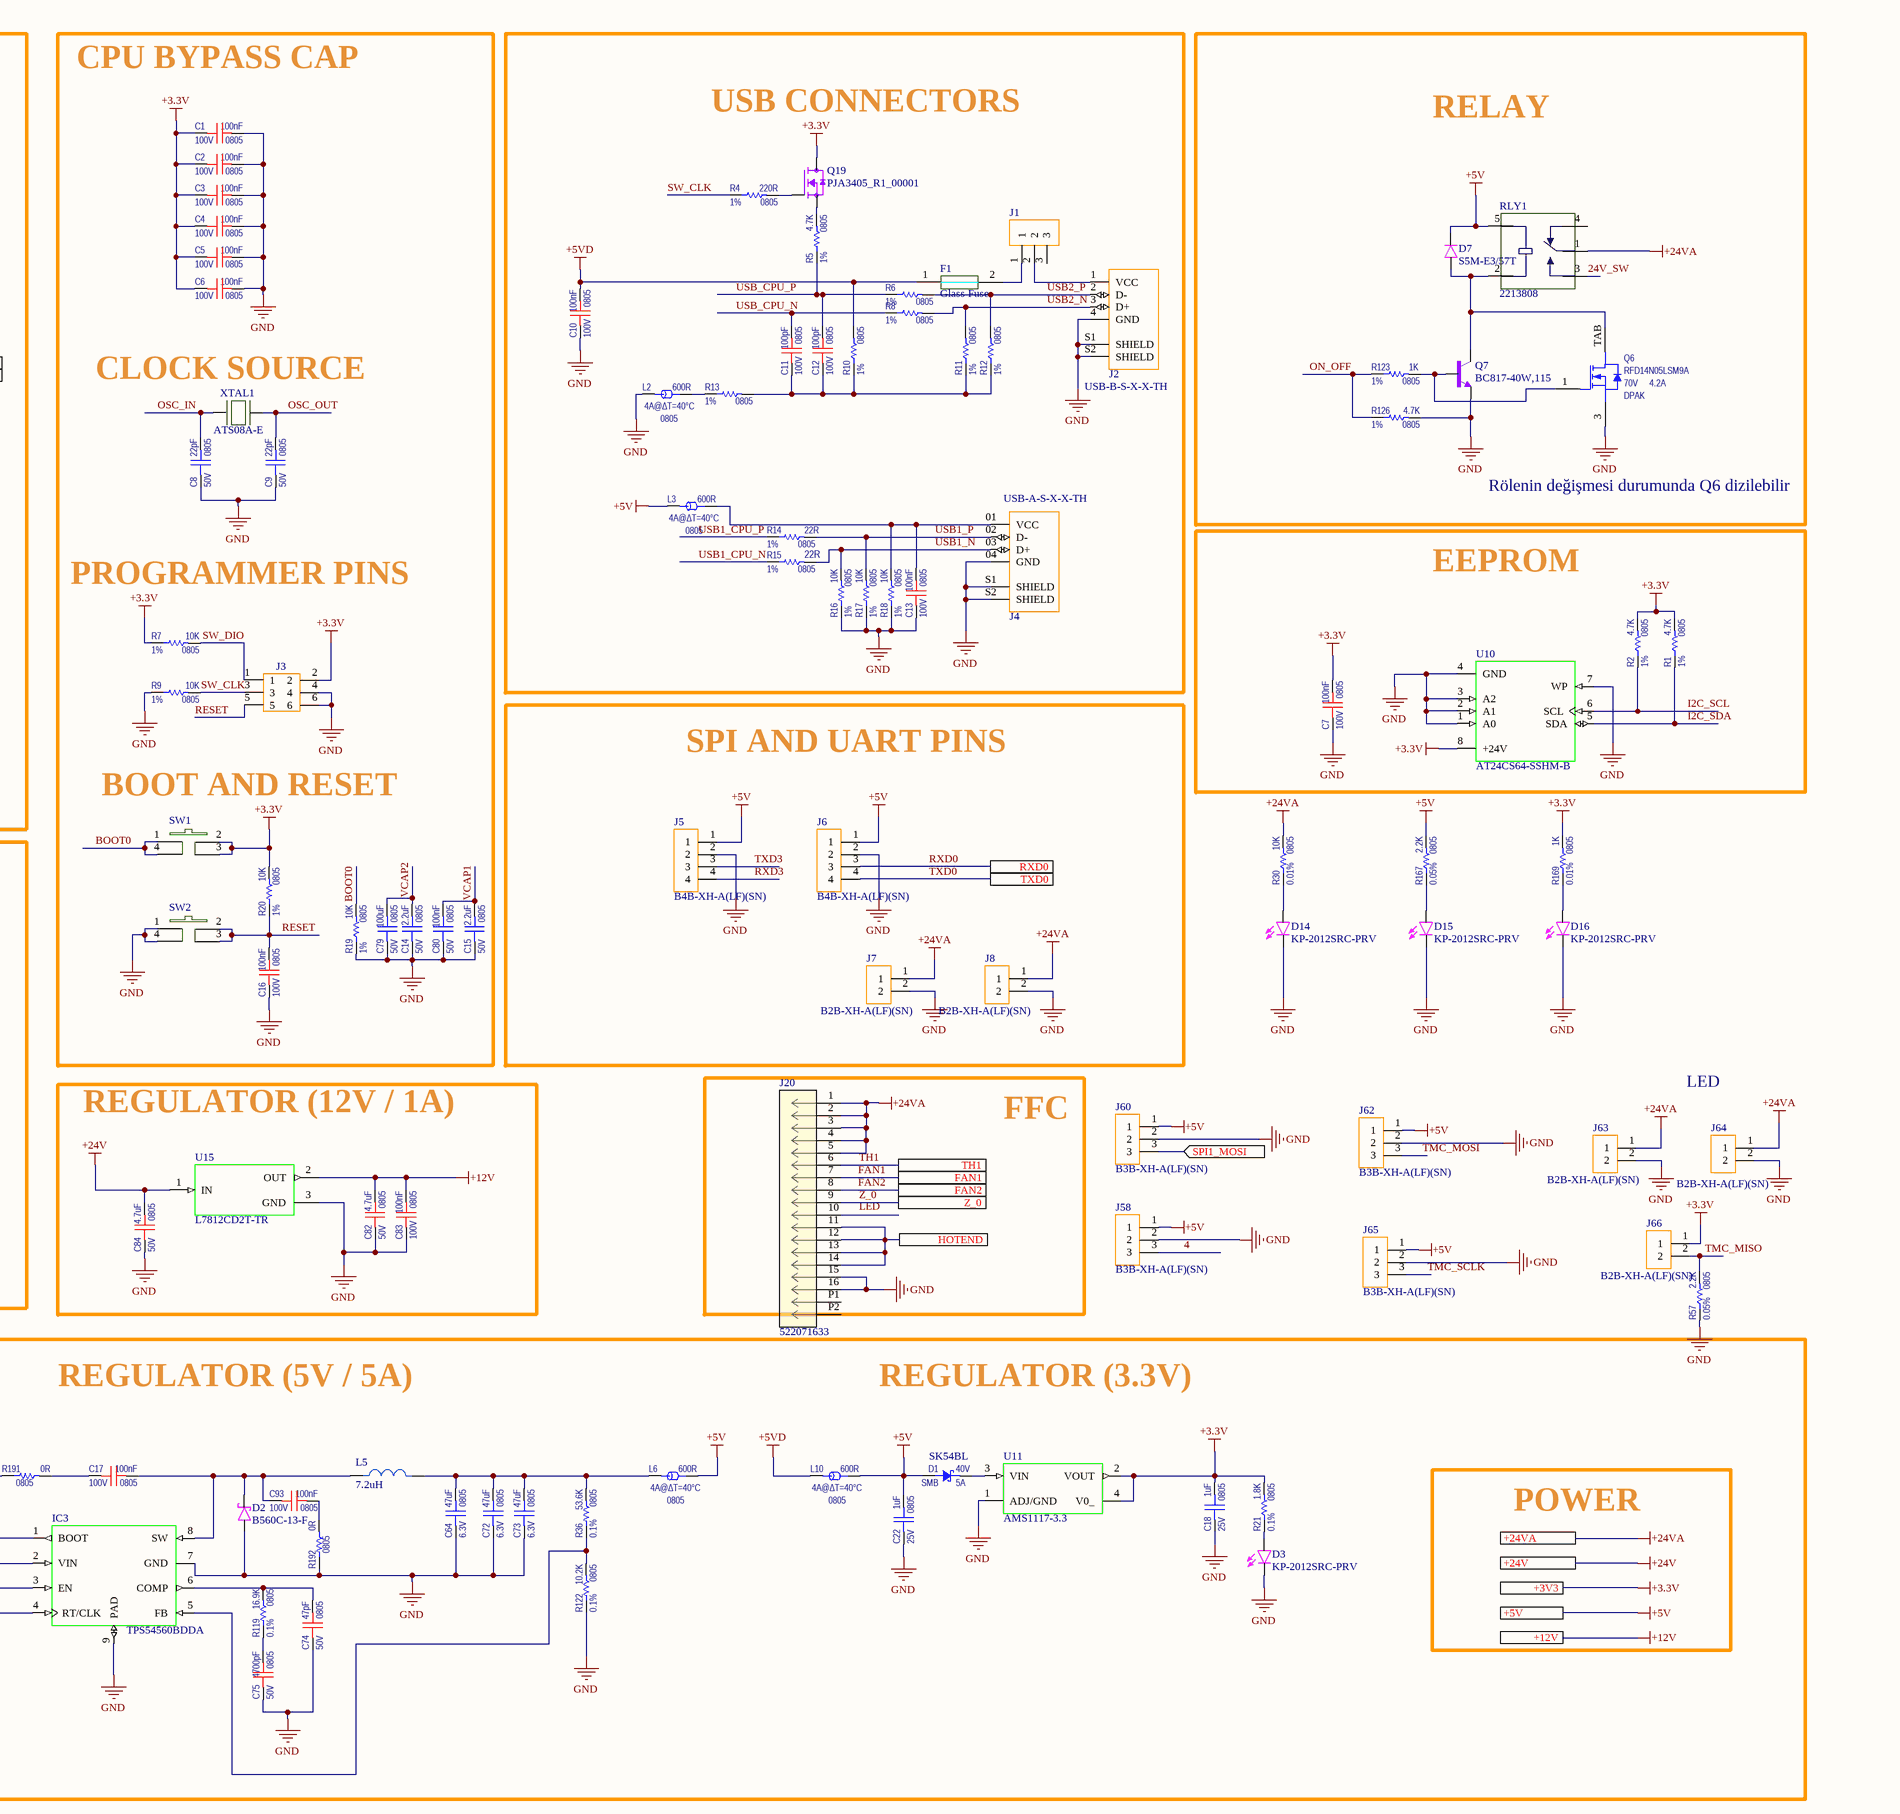
[diagram p6: Printing.SchDoc, right]

### Parts
C1  value 100nF  Voltage: 100V  Package: 0805  [C_0805_GEN_1.40H]  (hidden comment: ESDSafeCapacitor)
C2  value 100nF  Voltage: 100V  Package: 0805  [C_0805_GEN_1.40H]  (hidden comment: ESDSafeCapacitor)
C3  value 100nF  Voltage: 100V  Package: 0805  [C_0805_GEN_1.40H]  (hidden comment: ESDSafeCapacitor)
C4  value 100nF  Voltage: 100V  Package: 0805  [C_0805_GEN_1.40H]  (hidden comment: ESDSafeCapacitor)
C5  value 100nF  Voltage: 100V  Package: 0805  [C_0805_GEN_1.40H]  (hidden comment: ESDSafeCapacitor)
C6  value 100nF  Voltage: 100V  Package: 0805  [C_0805_GEN_1.40H]  (hidden comment: ESDSafeCapacitor)
C7  value 100nF  Voltage: 100V  Package: 0805  [C_0805_GEN_1.40H]  (hidden comment: ESDSafeCapacitor)
C8  value 22pF  Voltage: 50V  Package: 0805  [C_0805_GEN_1.10H]  (hidden comment: Capacitor)
C9  value 22pF  Voltage: 50V  Package: 0805  [C_0805_GEN_1.10H]  (hidden comment: Capacitor)
C10  value 100nF  Voltage: 100V  Package: 0805  [C_0805_GEN_1.40H]  (hidden comment: ESDSafeCapacitor)
C11  value 100pF  Voltage: 100V  Package: 0805  [C_0805_GEN_1.40H]  (hidden comment: ESDSafeCapacitor)
C12  value 100pF  Voltage: 100V  Package: 0805  [C_0805_GEN_1.40H]  (hidden comment: ESDSafeCapacitor)
C13  value 100nF  Voltage: 100V  Package: 0805  [C_0805_GEN_1.40H]  (hidden comment: ESDSafeCapacitor)
C14  value 2.2uF  Voltage: 50V  Package: 0805  [C_0805_GEN_1.40H]  (hidden comment: Capacitor)
C15  value 2.2uF  Voltage: 50V  Package: 0805  [C_0805_GEN_1.40H]  (hidden comment: Capacitor)
C16  value 100nF  Voltage: 100V  Package: 0805  [C_0805_GEN_1.40H]  (hidden comment: ESDSafeCapacitor)
C17  value 100nF  Voltage: 100V  Package: 0805  [C_0805_GEN_1.40H]  (hidden comment: ESDSafeCapacitor)
C18  value 1uF  Voltage: 25V  Package: 0805  [C_0805_GEN_1.40H]  (hidden comment: Capacitor)
C19  value 4.7uF  Voltage: 50V  Package: 0805  [C_0805_GEN_1.40H]  (hidden comment: ESDSafeCapacitor)
C20  100uF/50V  [SC1V107M6L07KVR]
C21  100uF/50V  [SC1V107M6L07KVR]
C22  value 1uF  Voltage: 25V  Package: 0805  [C_0805_GEN_1.40H]  (hidden comment: Capacitor)
C27  value 4.7uF  Voltage: 50V  Package: 0805  [C_0805_GEN_1.40H]  (hidden comment: ESDSafeCapacitor)
C37  value 2.2uF  Voltage: 50V  Package: 0805  [C_0805_GEN_1.40H]  (hidden comment: ESDSafeCapacitor)
C64  value 47uF  Voltage: 6.3V  Package: 0805  [C_0805_GEN_1.40H]  (hidden comment: Capacitor)
C70  value 100nF  Voltage: 100V  Package: 0805  [C_0805_GEN_1.40H]  (hidden comment: ESDSafeCapacitor)
C71  value 4.7uF  Voltage: 50V  Package: 0805  [C_0805_GEN_1.40H]  (hidden comment: ESDSafeCapacitor)
C72  value 47uF  Voltage: 6.3V  Package: 0805  [C_0805_GEN_1.40H]  (hidden comment: Capacitor)
C73  value 47uF  Voltage: 6.3V  Package: 0805  [C_0805_GEN_1.40H]  (hidden comment: Capacitor)
C74  value 47pF  Voltage: 50V  Package: 0805  [C_0805_GEN_1.40H]  (hidden comment: ESDSafeCapacitor)
C75  value 4700pF  Voltage: 50V  Package: 0805  [C_0805_GEN_1.40H]  (hidden comment: ESDSafeCapacitor)
C77  value 100nF  Voltage: 50V  Package: 0805  [C_0805_GEN_1.40H]  (hidden comment: ESDSafeCapacitor)
C79  value 100uF  Voltage: 50V  Package: 0805  [C_0805_GEN_1.40H]  (hidden comment: Capacitor)
C80  value 100nF  Voltage: 50V  Package: 0805  [C_0805_GEN_1.40H]  (hidden comment: Capacitor)
C82  value 4.7uF  Voltage: 50V  Package: 0805  [C_0805_GEN_1.40H]  (hidden comment: ESDSafeCapacitor)
C83  value 100nF  Voltage: 100V  Package: 0805  [C_0805_GEN_1.40H]  (hidden comment: ESDSafeCapacitor)
C84  value 4.7uF  Voltage: 50V  Package: 0805  [C_0805_GEN_1.40H]  (hidden comment: ESDSafeCapacitor)
C85  value 100nF  Voltage: 100V  Package: 0805  [C_0805_GEN_1.40H]  (hidden comment: ESDSafeCapacitor)
C93  value 100nF  Voltage: 100V  Package: 0805  [C_0805_GEN_1.40H]  (hidden comment: ESDSafeCapacitor)
C94  value 1nF  Voltage: 50V  Package: 0805  [C_0805_GEN_0.70H]  (hidden comment: Capacitor)
D1  SK54BL  Voltage: 40V  Current: 5A  Package: SMB  [SMB_NRVBS360BT3G]
D2  B560C-13-F  [B560C-13-F]
D3  KP-2012SRC-PRV  [0805 LED]
D6  KP-2012SRC-PRV  [0805 LED]
D7  S5M-E3/57T  [B560C-13-F]
D8  SK54BL  Voltage: 40V  Current: 5A  Package: SMB  [SMB_NRVBS360BT3G]
D14  KP-2012SRC-PRV  [0805 LED]
D15  KP-2012SRC-PRV  [0805 LED]
D16  KP-2012SRC-PRV  [0805 LED]
D17  SK54BL  Voltage: 40V  Current: 5A  Package: SMB  [SMB_NRVBS360BT3G]
F1  Glass Fuse  [2410 Sigorta]
Fuse1  5*20mm Fuseholder  [696310001002]
IC2  MCU-STM32F407VET6(LQFP100)  [LQFP100-0.5-13.8X13.8MM]  (value not drawn)
IC3  TPS54560BDDA  [VREG_LM5017MR/NOPB]
J1  L-KLS1-207-1-03-S  [L-KLS1-207-1-03-S]  (value not drawn)
J2  USB-B-S-X-X-TH  [SAMTEC_USB-B-S-X-X-TH]
J3  5PH1SDA25-203G0NNBL-3X6  [5PH1SDA25-203G0NNBL-3X6]  (value not drawn)
J4  USB-A-S-X-X-TH  [SAMTEC_USB-A-S-X-X-TH]
J5  B4B-XH-A(LF)(SN)  [JST_B4B-XH-A(LF)(SN)]
J6  B4B-XH-A(LF)(SN)  [JST_B4B-XH-A(LF)(SN)]
J7  B2B-XH-A(LF)(SN)  [JST_B2B-XH-A(LF)(SN)]
J8  B2B-XH-A(LF)(SN)  [JST_B2B-XH-A(LF)(SN)]
J10  5.08 Klemens  [5.08 Klemens]  (value not drawn)
J20  522071633  [CON_522071633_MOL]
J47  BH10B-XH-2(LF)(SN)  [BH10B-XH-2(LF)(SN)]  (value not drawn)
J58  B3B-XH-A(LF)(SN)  [JST_B3B-XH-A(LF)(SN)]
J60  B3B-XH-A(LF)(SN)  [JST_B3B-XH-A(LF)(SN)]
J62  B3B-XH-A(LF)(SN)  [JST_B3B-XH-A(LF)(SN)]
J63  B2B-XH-A(LF)(SN)  [JST_B2B-XH-A(LF)(SN)]
J64  B2B-XH-A(LF)(SN)  [JST_B2B-XH-A(LF)(SN)]
J65  B3B-XH-A(LF)(SN)  [JST_B3B-XH-A(LF)(SN)]
J66  B2B-XH-A(LF)(SN)  [JST_B2B-XH-A(LF)(SN)]
L1  value 600R  Current: 4A@ΔT=40°C  Package: 0805  [FB_0805_GEN_1.10H]  (hidden comment: FerriteBead)
L2  value 600R  Current: 4A@ΔT=40°C  Package: 0805  [FB_0805_GEN_1.10H]  (hidden comment: FerriteBead)
L3  value 600R  Current: 4A@ΔT=40°C  Package: 0805  [FB_0805_GEN_1.10H]  (hidden comment: FerriteBead)
L4  value 600R  Current: 4A@ΔT=40°C  Package: 0805  [FB_0805_GEN_1.10H]  (hidden comment: FerriteBead)
L5  7.2uH  [7447798720]
L6  value 600R  Current: 4A@ΔT=40°C  Package: 0805  [FB_0805_GEN_1.10H]  (hidden comment: FerriteBead)
L10  value 600R  Current: 4A@ΔT=40°C  Package: 0805  [FB_0805_GEN_1.10H]  (hidden comment: FerriteBead)
Q6  value RFD14N05LSM9A  Current: 4.2A  Voltage: 70V  Package: DPAK  [DPAK_SQD50N10-8M9L]  (hidden comment: SingleNMOS_G1S3DTAB)
Q7  BC817-40W,115  [BC817-40W,115]
Q19  PJA3405_R1_00001  [PJA3405_R1_00001]
R1  value 4.7K  Tolerance: 1%  Package: 0805  [R_0805_GEN_0.60H]  (hidden comment: StandardResistor)
R2  value 4.7K  Tolerance: 1%  Package: 0805  [R_0805_GEN_0.60H]  (hidden comment: StandardResistor)
R3  value 100K  Tolerance: 1%  Package: 0805  [R_0805_GEN_0.70H]  (hidden comment: StandardResistor)
R4  value 220R  Tolerance: 1%  Package: 0805  [R_0805_GEN_0.60H]  (hidden comment: StandardResistor)
R5  value 4.7K  Tolerance: 1%  Package: 0805  [R_0805_GEN_0.60H]  (hidden comment: StandardResistor)
R6  Tolerance: 1%  Package: 0805  [R_0805_GEN_0.60H]  (hidden comment: StandardResistor)
R7  value 10K  Tolerance: 1%  Package: 0805  [R_0805_GEN_0.70H]  (hidden comment: StandardResistor)
R8  Tolerance: 1%  Package: 0805  [R_0805_GEN_0.60H]  (hidden comment: StandardResistor)
R9  value 10K  Tolerance: 1%  Package: 0805  [R_0805_GEN_0.70H]  (hidden comment: StandardResistor)
R10  Tolerance: 1%  Package: 0805  [R_0805_GEN_0.60H]  (hidden comment: StandardResistor)
R11  Tolerance: 1%  Package: 0805  [R_0805_GEN_0.60H]  (hidden comment: StandardResistor)
R12  Tolerance: 1%  Package: 0805  [R_0805_GEN_0.60H]  (hidden comment: StandardResistor)
R13  Tolerance: 1%  Package: 0805  [R_0805_GEN_0.60H]  (hidden comment: StandardResistor)
R14  22R  Tolerance: 1%  Package: 0805  [R_0805_GEN_0.60H]
R15  22R  Tolerance: 1%  Package: 0805  [R_0805_GEN_0.60H]
R16  value 10K  Tolerance: 1%  Package: 0805  [R_0805_GEN_0.70H]  (hidden comment: StandardResistor)
R17  value 10K  Tolerance: 1%  Package: 0805  [R_0805_GEN_0.70H]  (hidden comment: StandardResistor)
R18  value 10K  Tolerance: 1%  Package: 0805  [R_0805_GEN_0.70H]  (hidden comment: StandardResistor)
R19  value 10K  Tolerance: 1%  Package: 0805  [R_0805_GEN_0.70H]  (hidden comment: StandardResistor)
R20  value 10K  Tolerance: 1%  Package: 0805  [R_0805_GEN_0.70H]  (hidden comment: StandardResistor)
R21  value 1.8K  Tolerance: 0.1%  Package: 0805  [R_0805_GEN_0.70H]  (hidden comment: StandardResistor)
R29  Package: 0805  [R_0805_GEN_0.70H]  (hidden comment: StandardJumper)
R30  value 10K  Tolerance: 0.01%  Package: 0805  [R_0805_GEN_0.70H]  (hidden comment: StandardResistor)
R34  value 442K  Tolerance: 0.1%  Package: 0805  [R_0805_GEN_0.70H]  (hidden comment: StandardResistor)
R36  value 53.6K  Tolerance: 0.1%  Package: 0805  [R_0805_GEN_0.70H]  (hidden comment: StandardResistor)
R57  value 2.2K  Tolerance: 0.05%  Package: 0805  [R_0805_GEN_0.70H]  (hidden comment: StandardResistor)
R113  value 10K  Tolerance: 1%  Package: 0805  [R_0805_GEN_0.70H]  (hidden comment: StandardResistor)
R114  value 10K  Tolerance: 1%  Package: 0805  [R_0805_GEN_0.70H]  (hidden comment: StandardResistor)
R115  value 10K  Tolerance: 1%  Package: 0805  [R_0805_GEN_0.70H]  (hidden comment: StandardResistor)
R116  value 10K  Tolerance: 1%  Package: 0805  [R_0805_GEN_0.70H]  (hidden comment: StandardResistor)
R117  value 10K  Tolerance: 1%  Package: 0805  [R_0805_GEN_0.70H]  (hidden comment: StandardResistor)
R118  value 1.8K  Tolerance: 0.1%  Package: 0805  [R_0805_GEN_0.70H]  (hidden comment: StandardResistor)
R119  value 16.9K  Tolerance: 0.1%  Package: 0805  [R_0805_GEN_0.70H]  (hidden comment: StandardResistor)
R120  value 90.9K  Tolerance: 0.1%  Package: 0805  [R_0805_GEN_0.70H]  (hidden comment: StandardResistor)
R121  value 243K  Tolerance: 0.1%  Package: 0805  [R_0805_GEN_0.70H]  (hidden comment: StandardResistor)
R122  value 10.2K  Tolerance: 0.1%  Package: 0805  [R_0805_GEN_0.70H]  (hidden comment: StandardResistor)
R123  1K  Tolerance: 1%  Package: 0805  [R_0805_GEN_0.60H]
R126  value 4.7K  Tolerance: 1%  Package: 0805  [R_0805_GEN_0.60H]  (hidden comment: StandardResistor)
R167  value 2.2K  Tolerance: 0.05%  Package: 0805  [R_0805_GEN_0.70H]  (hidden comment: StandardResistor)
R169  value 1K  Tolerance: 0.01%  Package: 0805  [R_0805_GEN_0.70H]  (hidden comment: StandardResistor)
R174  Package: 0805  [R_0805_GEN_0.70H]  (hidden comment: StandardJumper)
R175  Package: 0805  [R_0805_GEN_0.70H]  (hidden comment: StandardJumper)
R186  value 4.7K  Tolerance: 1%  Package: 0805  [R_0805_GEN_0.60H]  (hidden comment: StandardResistor)
R191  value 0R  Package: 0805  [R_0805_GEN_0.70H]  (hidden comment: PlaceHolder)
R192  value 0R  Package: 0805  [R_0805_GEN_0.70H]  (hidden comment: PlaceHolder)
RLY1  Supplier Part Number 1: 2213808  [relay]  (hidden comment: G5RL-1A-E-HR-DC24)
SW1  L-KLS7-TS4502-6.5-180-T  [L-KLS7-TS4502-6.5-180-T]  (value not drawn)
SW2  L-KLS7-TS4502-6.5-180-T  [L-KLS7-TS4502-6.5-180-T]  (value not drawn)
U10  AT24CS64-SSHM-B  [SOIC127P599X175-8N]
U11  AMS1117-3.3  [SOT229P700X180-4N]
U15  L7812CD2T-TR  [TO254P1515X470-3N]
XTAL1  ATS08A-E  [XTAL_HC49P488W43L1085T450H368]

### Blocks framed on the sheet
CPU CONNECTION: C37 C77 IC2 L1 R3 R174 R186
USB CONNECTORS: C10-C13 F1 J1 J2 J4 L2 L3 Q19 R4-R6 R8 R10-R18
RELAY: D7 Q6 Q7 R123 R126 RLY1
EEPROM: C7 R1 R2 U10
SPI AND UART PINS: J5-J8
SD CARD: C70 C71 D6 J47 R29 R113-R118 R175
REGULATOR (12V / 1A): C82-C84 U15
FFC: J20

### Ports
12V_MOTOR, +3V3, +5V, +12V, +24V, +24VA, BTN_EN1 (in), BTN_EN2 (in), Cam, E0_DIR (in), E0_EN (in), E0_STEP (in), E0_UART (in), E1- (in), E1_DIR (in), E1_EN (in), E1_STEP (in), E1_UART (in), ESP_EN (in), FAN1, FAN1 (in), FAN2, FAN2 (in), HEATER2 (in), HEATER (out), HOTBED (in), HOTEND, IN22 (out), MOS_1 (in), MOS_2 (in), MOS_3 (in), MOS_4 (in), MOS_5 (in), MOS_6 (in), MOS_7 (in), MOS_8 (in), MOS_9 (in), MT_DET1 (in), MT_DET2 (in), PA5 (in), PA6 (in), PA8 (in), RESET (in), RXD0, SPI1_MOSI (in), SPI3_CS (in), SPI3_MISO (in), SPI3_MOSI (in), SPI3_SCK (in), SSR_2, TB (in), TH1, TH1 (in), TH2 (in), TXD0, WIFI_IO0 (in), X- (in), X_DIR (in), X_EN (in), X_STEP (in), X_UART (in), Y- (in), Y_DIR, Y_EN (in), Y_STEP (in), Y_UART (in), Z- (in), Z_0, Z_DIR (in), Z_EN (in), Z_STEP (in), Z_UART (in)

### Nets
+3.3V: C1.1 C2.1 C3.1 C4.1 C5.1 C6.1 C7.2 C18.2 C70.2 C71.2 IC2.11(VDD@1) IC2.19(VDD@2) IC2.21(VREF+) IC2.28(VDD@3) IC2.50(VDD@4) IC2.75(VDD@5) IC2.100(VDD@6) J3.2 J47.4 J66.1 L1.1 Q19.3(D) R1.2 R2.2 R7.1 R20.2 R21.2 R113.2 R114.2 R115.2 R116.2 R117.2 R118.1 R169.2 R186.2 SW1.2(B0) SW1.3(B1) U10.8(+24V) U11.2(VOUT) U11.4(V0_) ; port +3V3  [project net +3V3]
+5V: C22.2 D1.2(A) D7.K J5.1 J6.1 J58.1 J60.1 J62.1 J65.1 L3.1 L6.2 L10.2 R167.2 RLY1.5(COIL1) ; port +5V
+5VD: C10.2 F1.1 L10.1 R10.2
+12V: C82.2 C83.2 U15.2(OUT) ; port +12V
+24V: C20.1 C21.1 C84.2 C85.2 D8.1(C) D17.1(C) L4.1 U15.1(IN) ; port +24V
+24VA: J7.1 J8.1 J20.1 J20.2 J20.3 J20.4 J20.5 J63.1 J64.1 R30.2 RLY1.1(COM) ; port +24VA
GND: C1.2 C2.2 C3.2 C4.2 C5.2 C6.2 C7.1 C8.1 C9.1 C10.1 C13.1 C14.1 C15.1 C16.1 C18.1 C19.1 C20.2 C21.2 C22.1 C27.1 C37.1 C64.1 C70.1 C71.1 C72.1 C73.1 C74.1 C75.1 C77.1 C79.1 C80.1 C82.1 C83.1 C84.1 C85.1 C94.1 D2.A D3.K(C) D14.K(C) D15.K(C) D16.K(C) IC2.10(VSS@1) IC2.20(VSSA) IC2.27(VSS@2) IC2.74(VSS@3) IC2.99(VSS@4) IC3.7(GND) IC3.9(PAD) J2.4(GND) J2.S1(SHIELD) J2.S2(SHIELD) J3.4 J3.6 J4.04(GND) J4.S1(SHIELD) J4.S2(SHIELD) J5.2 J6.2 J7.2 J8.2 J10.2 J20.15 J20.16 J47.6 J47.10 J58.2 J60.2 J62.2 J63.2 J64.2 J65.2 L2.1 Q6.3(SOURCE) Q7.2(E) R3.2 R9.1 R16.1 R17.1 R18.1 R19.1 R29.2 R57.1 R120.1 R121.1 R122.1 R126.2 R192.1 SW2.1(A0) SW2.4(A1) U10.1(A0) U10.2(A1) U10.3(A2) U10.4(GND) U10.7(WP) U11.1(ADJ/GND) U15.3(GND)
4: IC2.17(PC2) J58.3
12V_MOTOR: IC2.64(PC7) ; port 12V_MOTOR
24V_SW: Fuse1.1 J10.1 RLY1.3(NO)
BOOT0: IC2.94(BOOT0) R19.2 SW1.1(A0) SW1.4(A1)
BTN_EN1: IC2.33(PC4) ; port BTN_EN1
BTN_EN2: IC2.34(PC5) ; port BTN_EN2
CAM: IC2.18(PC3) ; port Cam
E0_DIR: IC2.84(PD3) ; port E0_DIR
E0_EN: IC2.89(PB3) ; port E0_EN
E0_STEP: IC2.87(PD6) ; port E0_STEP
E0_UART: IC2.56(PD9) ; port E0_UART
E1-: IC2.38(PE7) ; port E1-
E1_DIR: IC2.24(PA1) ; port E1_DIR
E1_EN: IC2.26(PA3) ; port E1_EN
E1_STEP: IC2.62(PD15) ; port E1_STEP
E1_UART: IC2.55(PD8) ; port E1_UART
ESP_EN: IC2.40(PE9) ; port ESP_EN
FAN1: IC2.8(PC14) J20.7 ; port FAN1
FAN2: IC2.36(PB1) J20.8 ; port FAN2
HEATER: IC2.4(PE5) ; port HEATER
HEATER2: IC2.35(PB0) ; port HEATER2
HOTBED: IC2.23(PA0) ; port HOTBED
HOTEND: J20.11 J20.12 J20.13 J20.14 ; port HOTEND
I2C_SCL: IC2.92(PB6) R2.1 U10.6(SCL)
I2C_SDA: IC2.93(PB7) R1.1 U10.5(SDA)
IN22: IC2.52(PB13) ; port IN22
LED: IC2.9(PC15)
MOS_1: IC2.63(PC6) ; port MOS_1
MOS_2: IC2.58(PD11) ; port MOS_2
MOS_3: IC2.57(PD10) ; port MOS_3
MOS_4: IC2.46(PE15) ; port MOS_4
MOS_5: IC2.44(PE13) ; port MOS_5
MOS_6: IC2.43(PE12) ; port MOS_6
MOS_7: IC2.41(PE10) ; port MOS_7
MOS_8: IC2.39(PE8) ; port MOS_8
MOS_9: IC2.60(PD13) ; port MOS_9
MT_DET1: IC2.29(PA4) ; port MT_DET1
MT_DET2: IC2.5(PE6) ; port MT_DET2
ON_OFF: IC2.42(PE11) R123.1 R126.1
OSC_IN: C8.2 IC2.12(PH0) XTAL1.1
OSC_OUT: C9.2 IC2.13(PH1) XTAL1.2
PA5: IC2.30(PA5) ; port PA5
PA6: IC2.31(PA6) ; port PA6
PA8: IC2.67(PA8) ; port PA8
RESET: C16.2 IC2.14(NRST) J3.5 R20.1 SW2.2(B0) SW2.3(B1) ; port RESET
RXD0: IC2.69(PA10) J6.3 ; port RXD0
RXD3: IC2.48(PB11) J5.4
SD_DET: D6.K(C) IC2.59(PD12) J47.9 R113.1
SPI1_MOSI: IC2.32(PA7) J60.3 ; port SPI1_MOSI
SPI3_CS: R117.1 R174.2 R175.1 R186.1 ; port SPI3_CS
SPI3_MISO: IC2.79(PC11) J47.7 R114.1 ; port SPI3_MISO
SPI3_MOSI: IC2.80(PC12) J47.3 R116.1 ; port SPI3_MOSI
SPI3_SCK: IC2.78(PC10) J47.5 R115.1 ; port SPI3_SCK
SSR_2: IC2.45(PE14) ; port SSR_2
SW_CLK: IC2.76(PA14) J3.3 R4.1 R9.2
SW_DIO: IC2.72(PA13) J3.1 R7.2
TB: IC2.15(PC0) ; port TB
TH1: IC2.16(PC1) J20.6 ; port TH1
TH2: IC2.25(PA2) ; port TH2
TMC_MISO: IC2.82(PD1) J66.2 R57.2
TMC_MOSI: IC2.61(PD14) J62.3
TMC_SCLK: IC2.81(PD0) J65.3
TXD0: IC2.68(PA9) J6.4 ; port TXD0
TXD3: IC2.47(PB10) J5.3
USB1_CPU_N: IC2.53(PB14) R15.1
USB1_CPU_P: IC2.54(PB15) R14.1
USB1_N: J4.03(D+) R15.2 R16.2
USB1_P: J4.02(D-) R14.2 R17.2
USB2_N: J2.3(D+) R8.2 R11.2
USB2_P: J2.2(D-) R6.2 R12.2
USB_CPU_N: C11.2 IC2.70(PA11) R8.1
USB_CPU_P: C12.2 IC2.71(PA12) R5.1 R6.1
VCAP1: C15.2 C80.2 IC2.49(VCAP_1)
VCAP2: C14.2 C79.2 IC2.73(VCAP_2)
WIFI_IO0: IC2.7(PC13) ; port WIFI_IO0
X-: IC2.77(PA15) ; port X-
X_DIR: IC2.1(PE2) ; port X_DIR
X_EN: IC2.3(PE4) ; port X_EN
X_STEP: IC2.2(PE3) ; port X_STEP
X_UART: IC2.86(PD5) ; port X_UART
Y-: IC2.83(PD2) ; port Y-
Y_DIR: IC2.96(PB9) ; port Y_DIR
Y_EN: IC2.98(PE1) ; port Y_EN
Y_STEP: IC2.97(PE0) ; port Y_STEP
Y_UART: IC2.88(PD7) ; port Y_UART
Z-: IC2.65(PC8) ; port Z-
Z_0: J20.9 ; port Z_0
Z_DIR: IC2.90(PB4) ; port Z_DIR
Z_EN: IC2.95(PB8) ; port Z_EN
Z_STEP: IC2.91(PB5) ; port Z_STEP
Z_UART: IC2.85(PD4) ; port Z_UART
NetC11_1: C11.1 C12.1 R10.1 R11.1 R12.1 R13.2
NetC13_2: C13.2 J4.01(VCC) L3.2 R18.2
NetC17_1: C17.1 R191.2
NetC17_2: C17.2 C93.1 D2.K IC3.8(SW) L5.1
NetC19_2: C19.2 C27.2 C94.2 IC3.2(VIN) L4.2 R34.2
NetC37_2: C37.2 C77.2 IC2.22(VDDA) L1.2
NetC64_2: C64.2 C72.2 C73.2 L5.2 L6.1 R36.2
NetC74_2: C74.2 IC3.6(COMP) R119.2
NetC75_2: C75.2 R119.1
NetC93_2: C93.2 R192.2
NetD1_1: D1.1(C) U11.3(VIN)
NetD3_A: D3.A R21.1
NetD6_A: D6.A R118.2
NetD7_A: D7.A Q6.TAB(DRAIN) Q7.3(C) RLY1.2(COIL2)
NetD8_2: D8.2(A) D17.2(A) Fuse1.2
NetD14_A: D14.A R30.1
NetD15_A: D15.A R167.1
NetD16_A: D16.A R169.1
NetF1_2: F1.2 J1.1
NetIC2_37: IC2.37(PB2) R3.1
NetIC2_66: IC2.66(PC9) R174.1
NetIC3_1: IC3.1(BOOT) R191.1
NetIC3_3: IC3.3(EN) R34.1 R120.2
NetIC3_4: IC3.4(RT/CLK) R121.2
NetIC3_5: IC3.5(FB) R36.1 R122.2
NetJ1_2: J1.2 J2.1(VCC)
NetJ47_2: J47.2 R29.1 R175.2
NetL2_2: L2.2 R13.1
NetQ6_1: Q6.1(GATE) Q7.1(B) R123.2
NetQ19_1: Q19.1(G) R4.2
NetQ19_2: Q19.2(S) R5.2

Not connected (* = marked no-connect by the designer): IC2 6(VBAT) 51(PB12); J1 3; J20 10 P1 P2; J47 1 8; RLY1 4(NC)

### Notes on the sheet
- CPU BYPASS CAP
- (near XTAL1) CLOCK SOURCE
- Rölenin değişmesi durumunda Q6 dizilebilir
- PROGRAMMER PINS
- (near SW1) BOOT AND RESET
- LED
- REGULATOR (5V / 5A)
- REGULATOR (3.3V)
- POWER
- Labels drawn without touching a wire or pin: LED
- Title
- Size:
- Date:
- File:
- A2
- Number:
- Time:
- Revision:
- Sheet
- of